# Altium project PCB_Project1.PrjPCB (part 1 of 2)
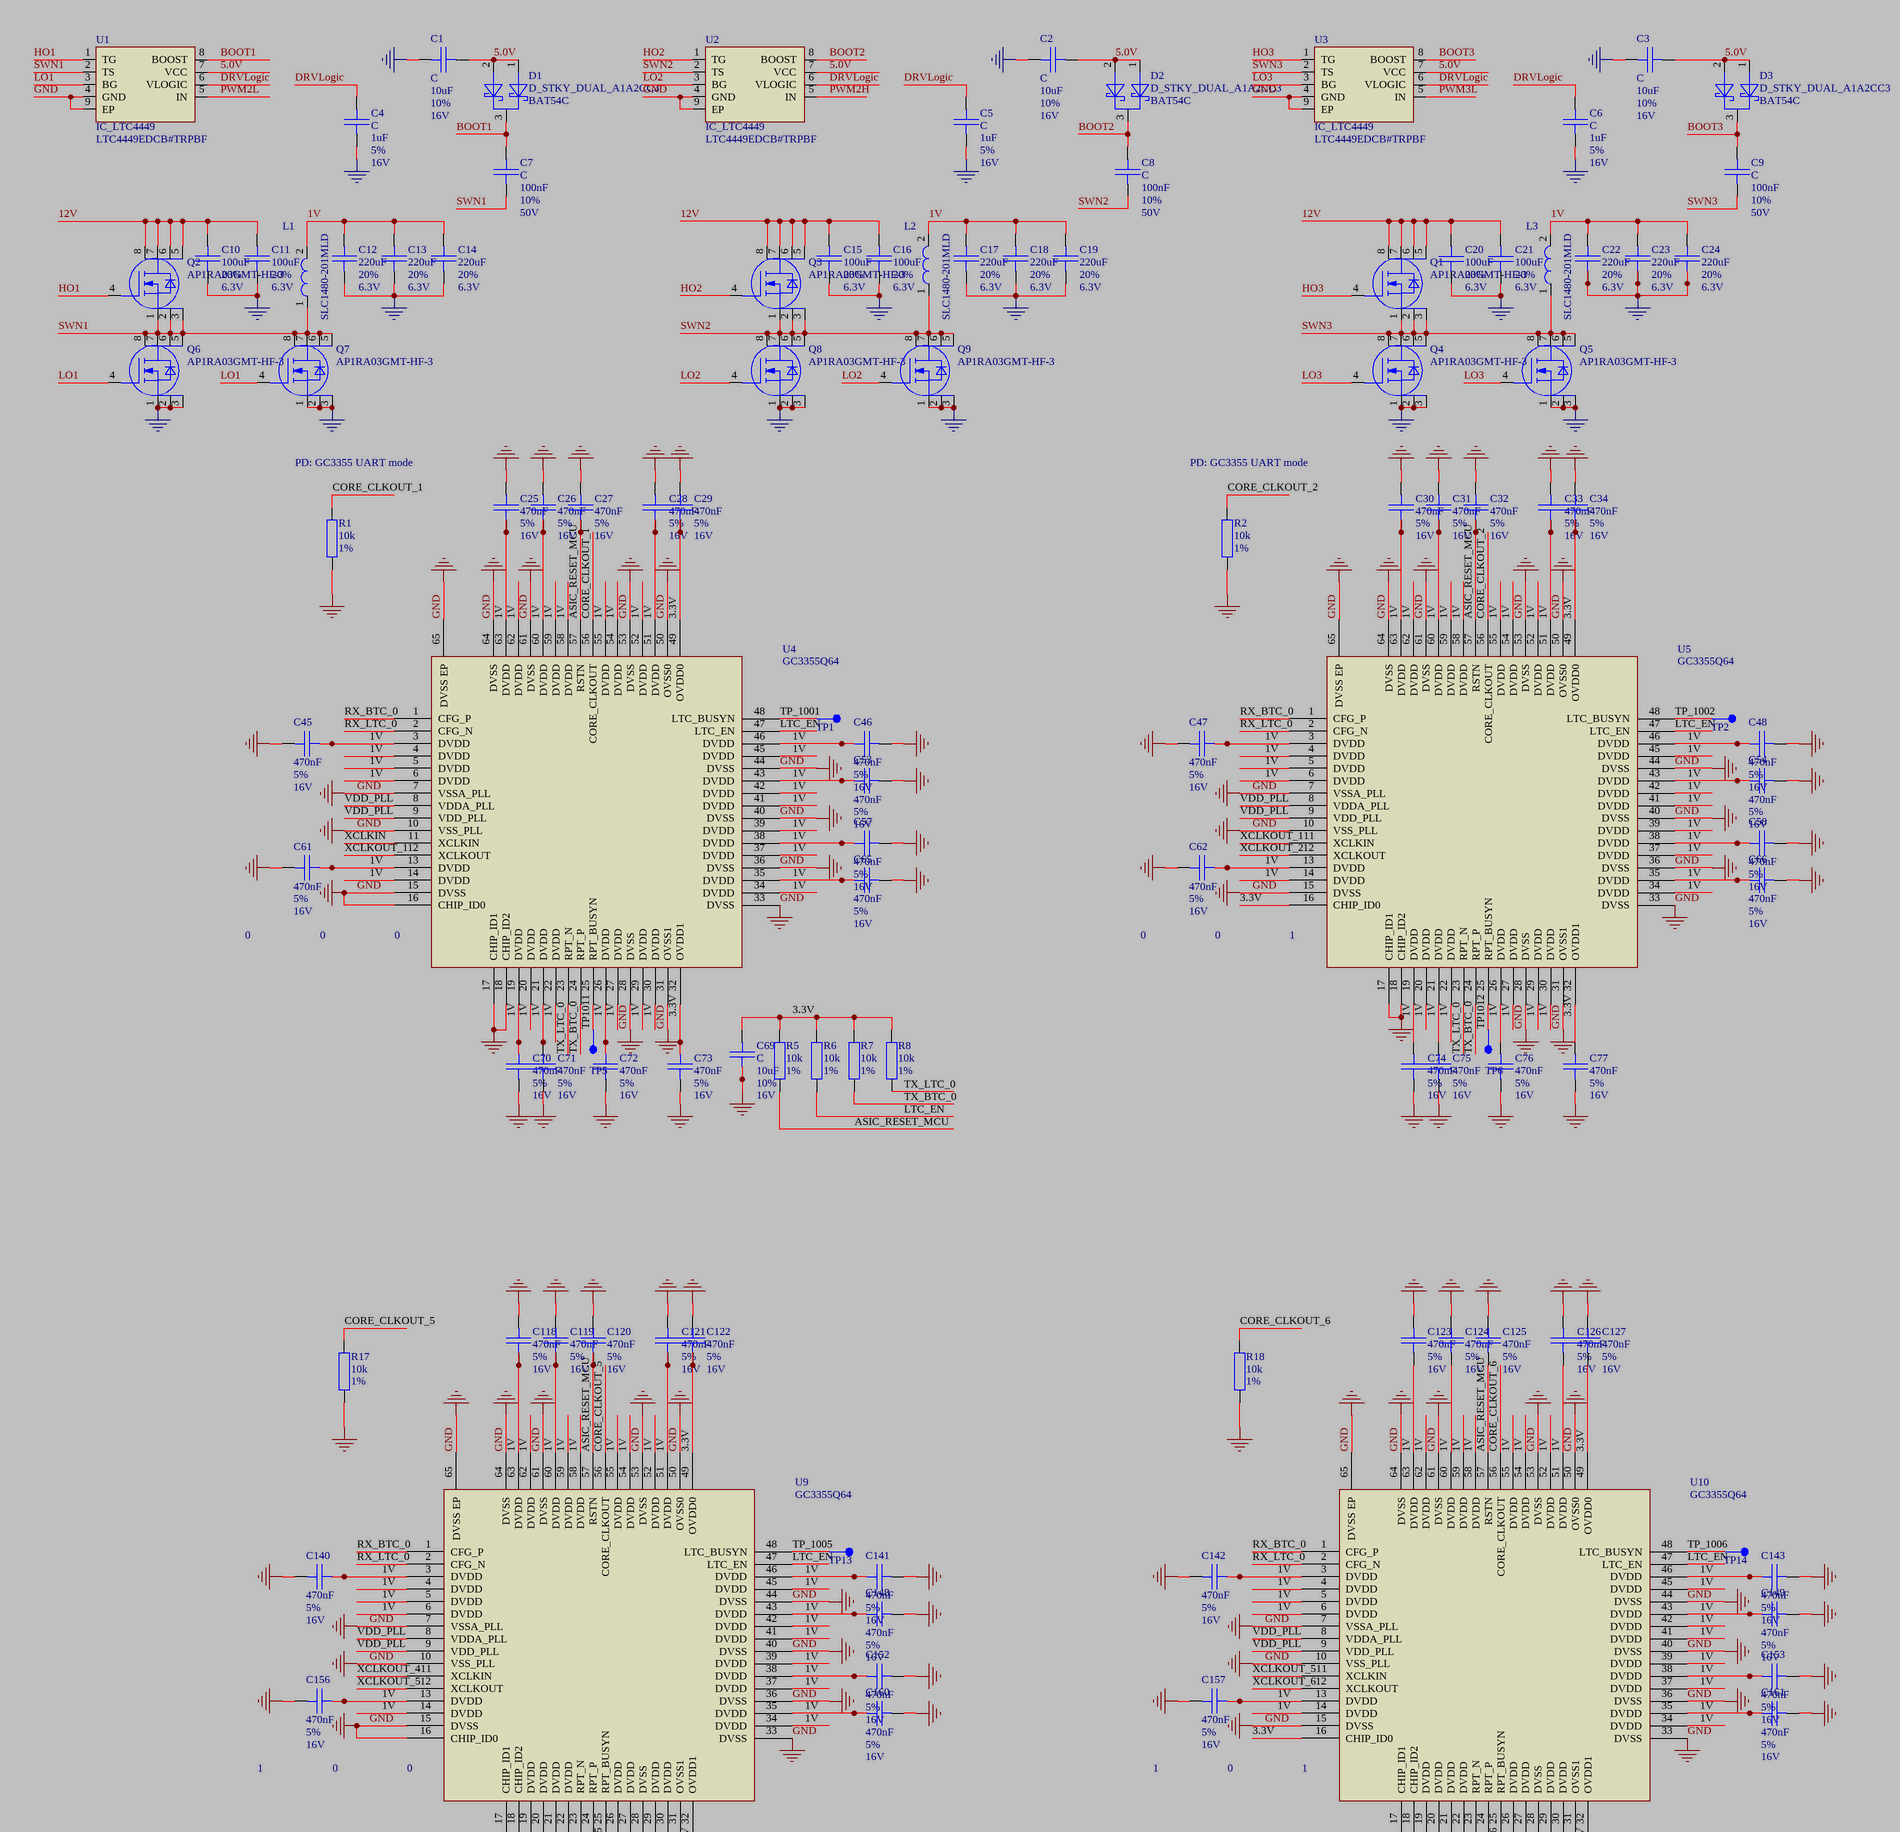
[diagram p0: GridSeed.SchDoc, top left]
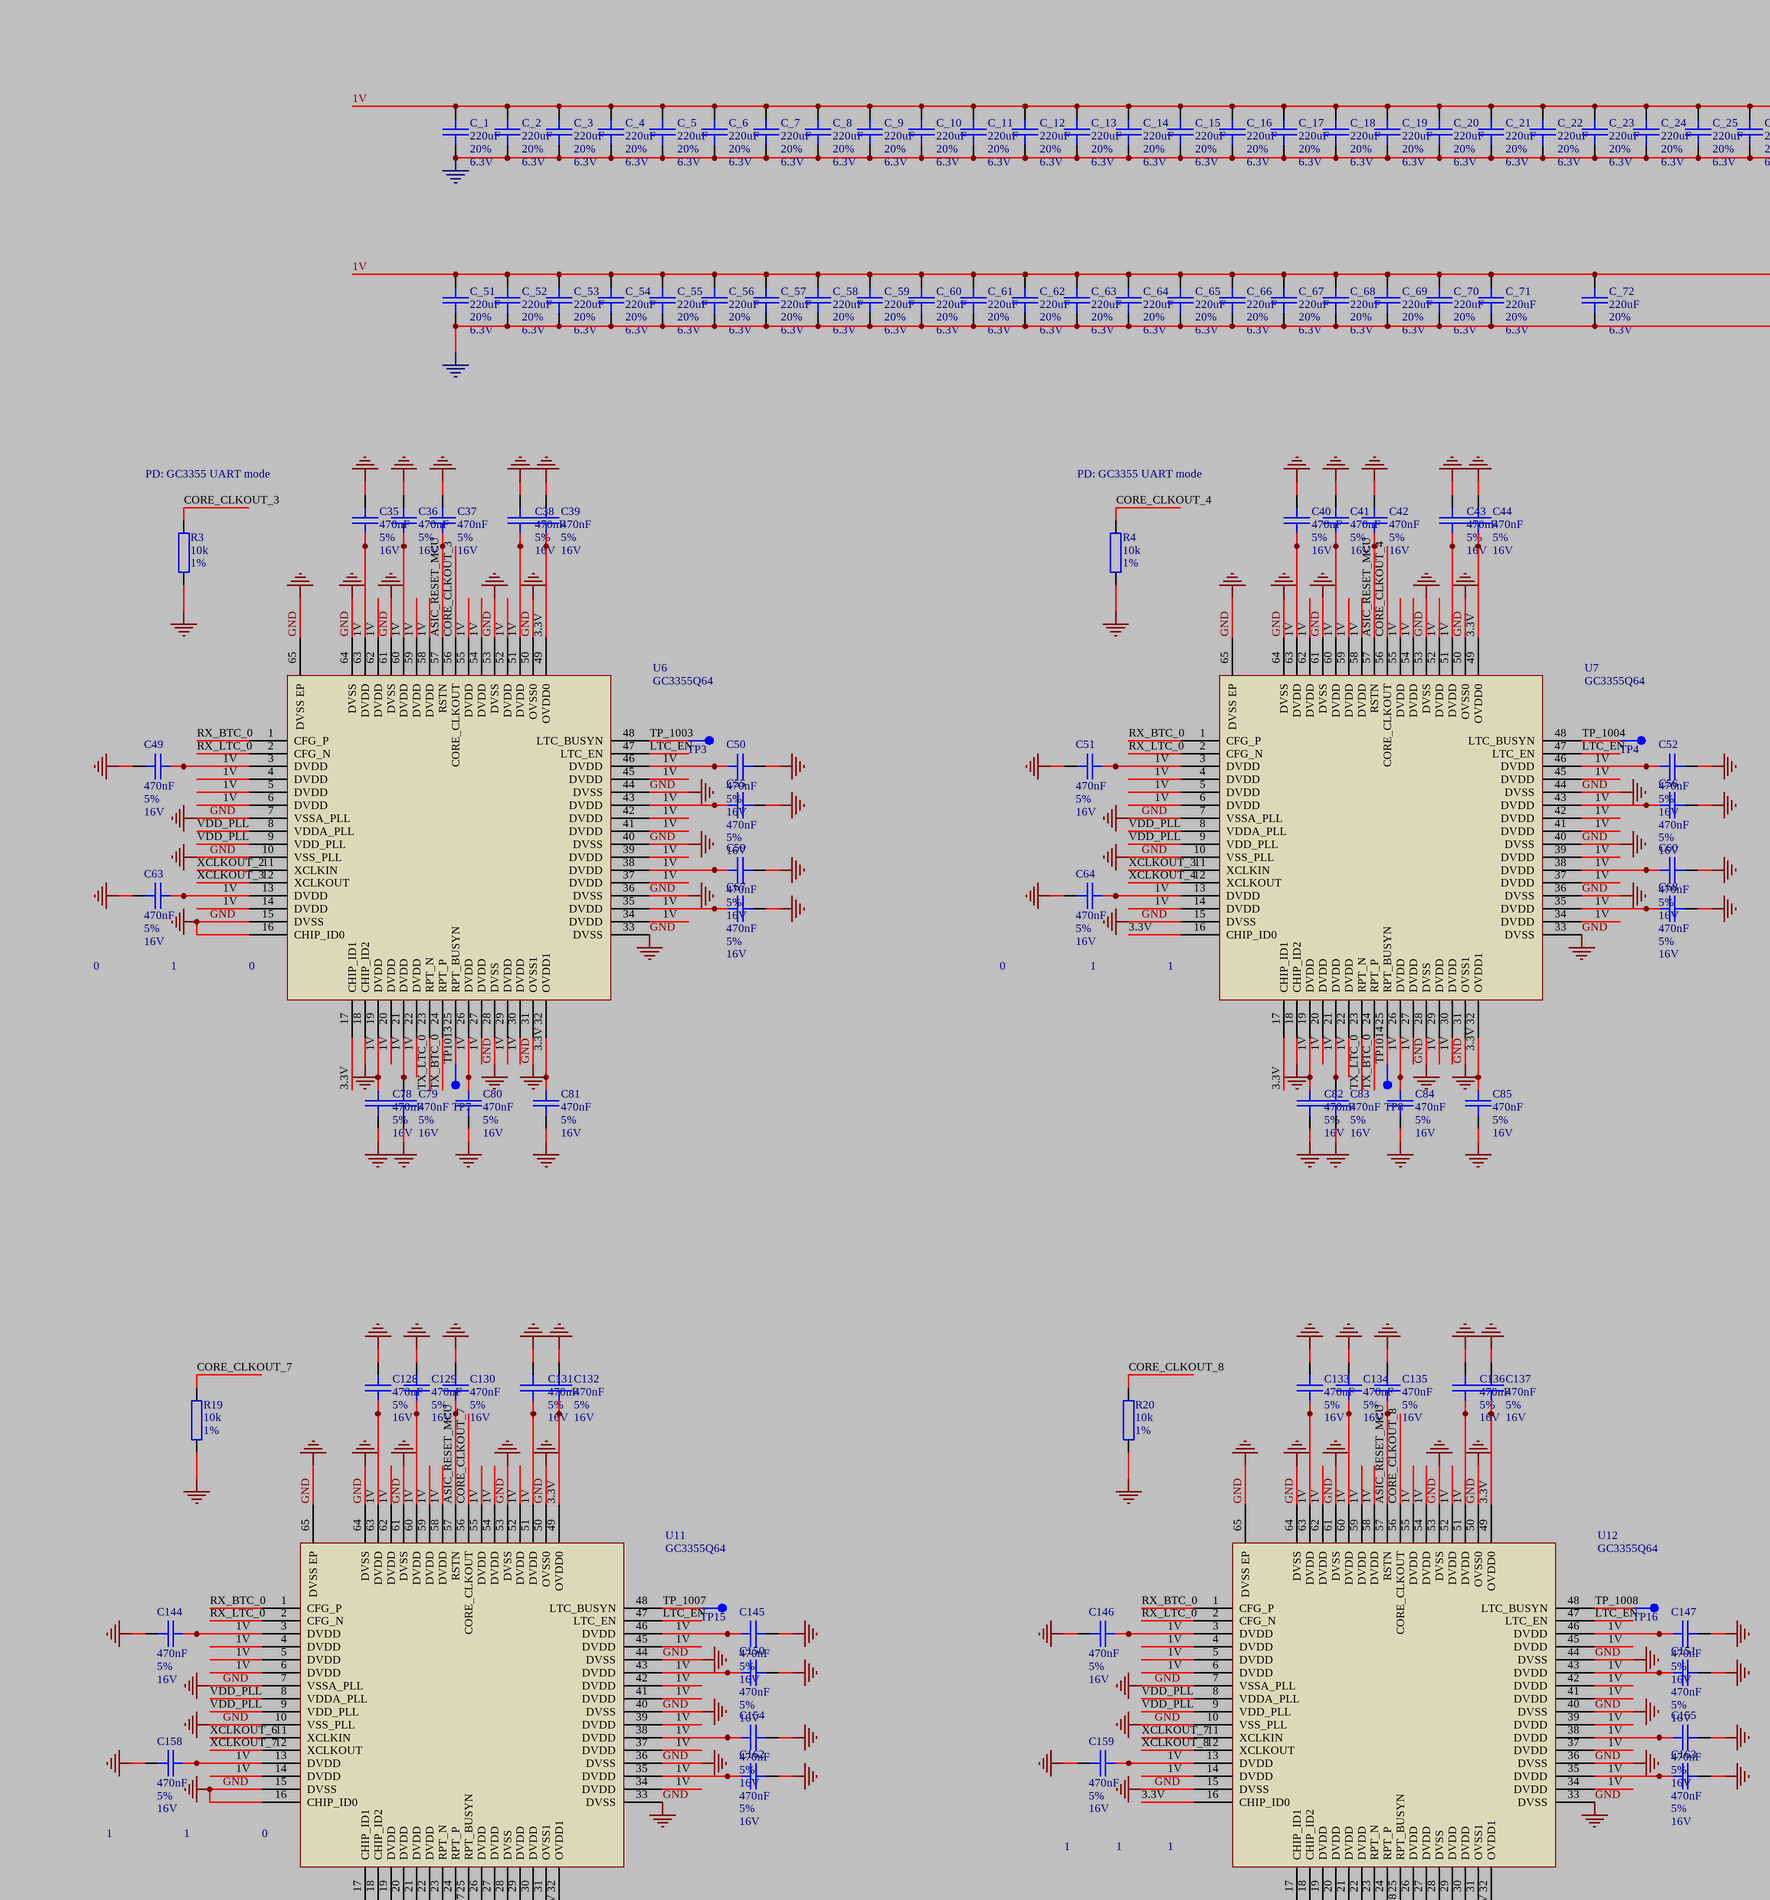
[diagram p1: GridSeed.SchDoc, top middle]
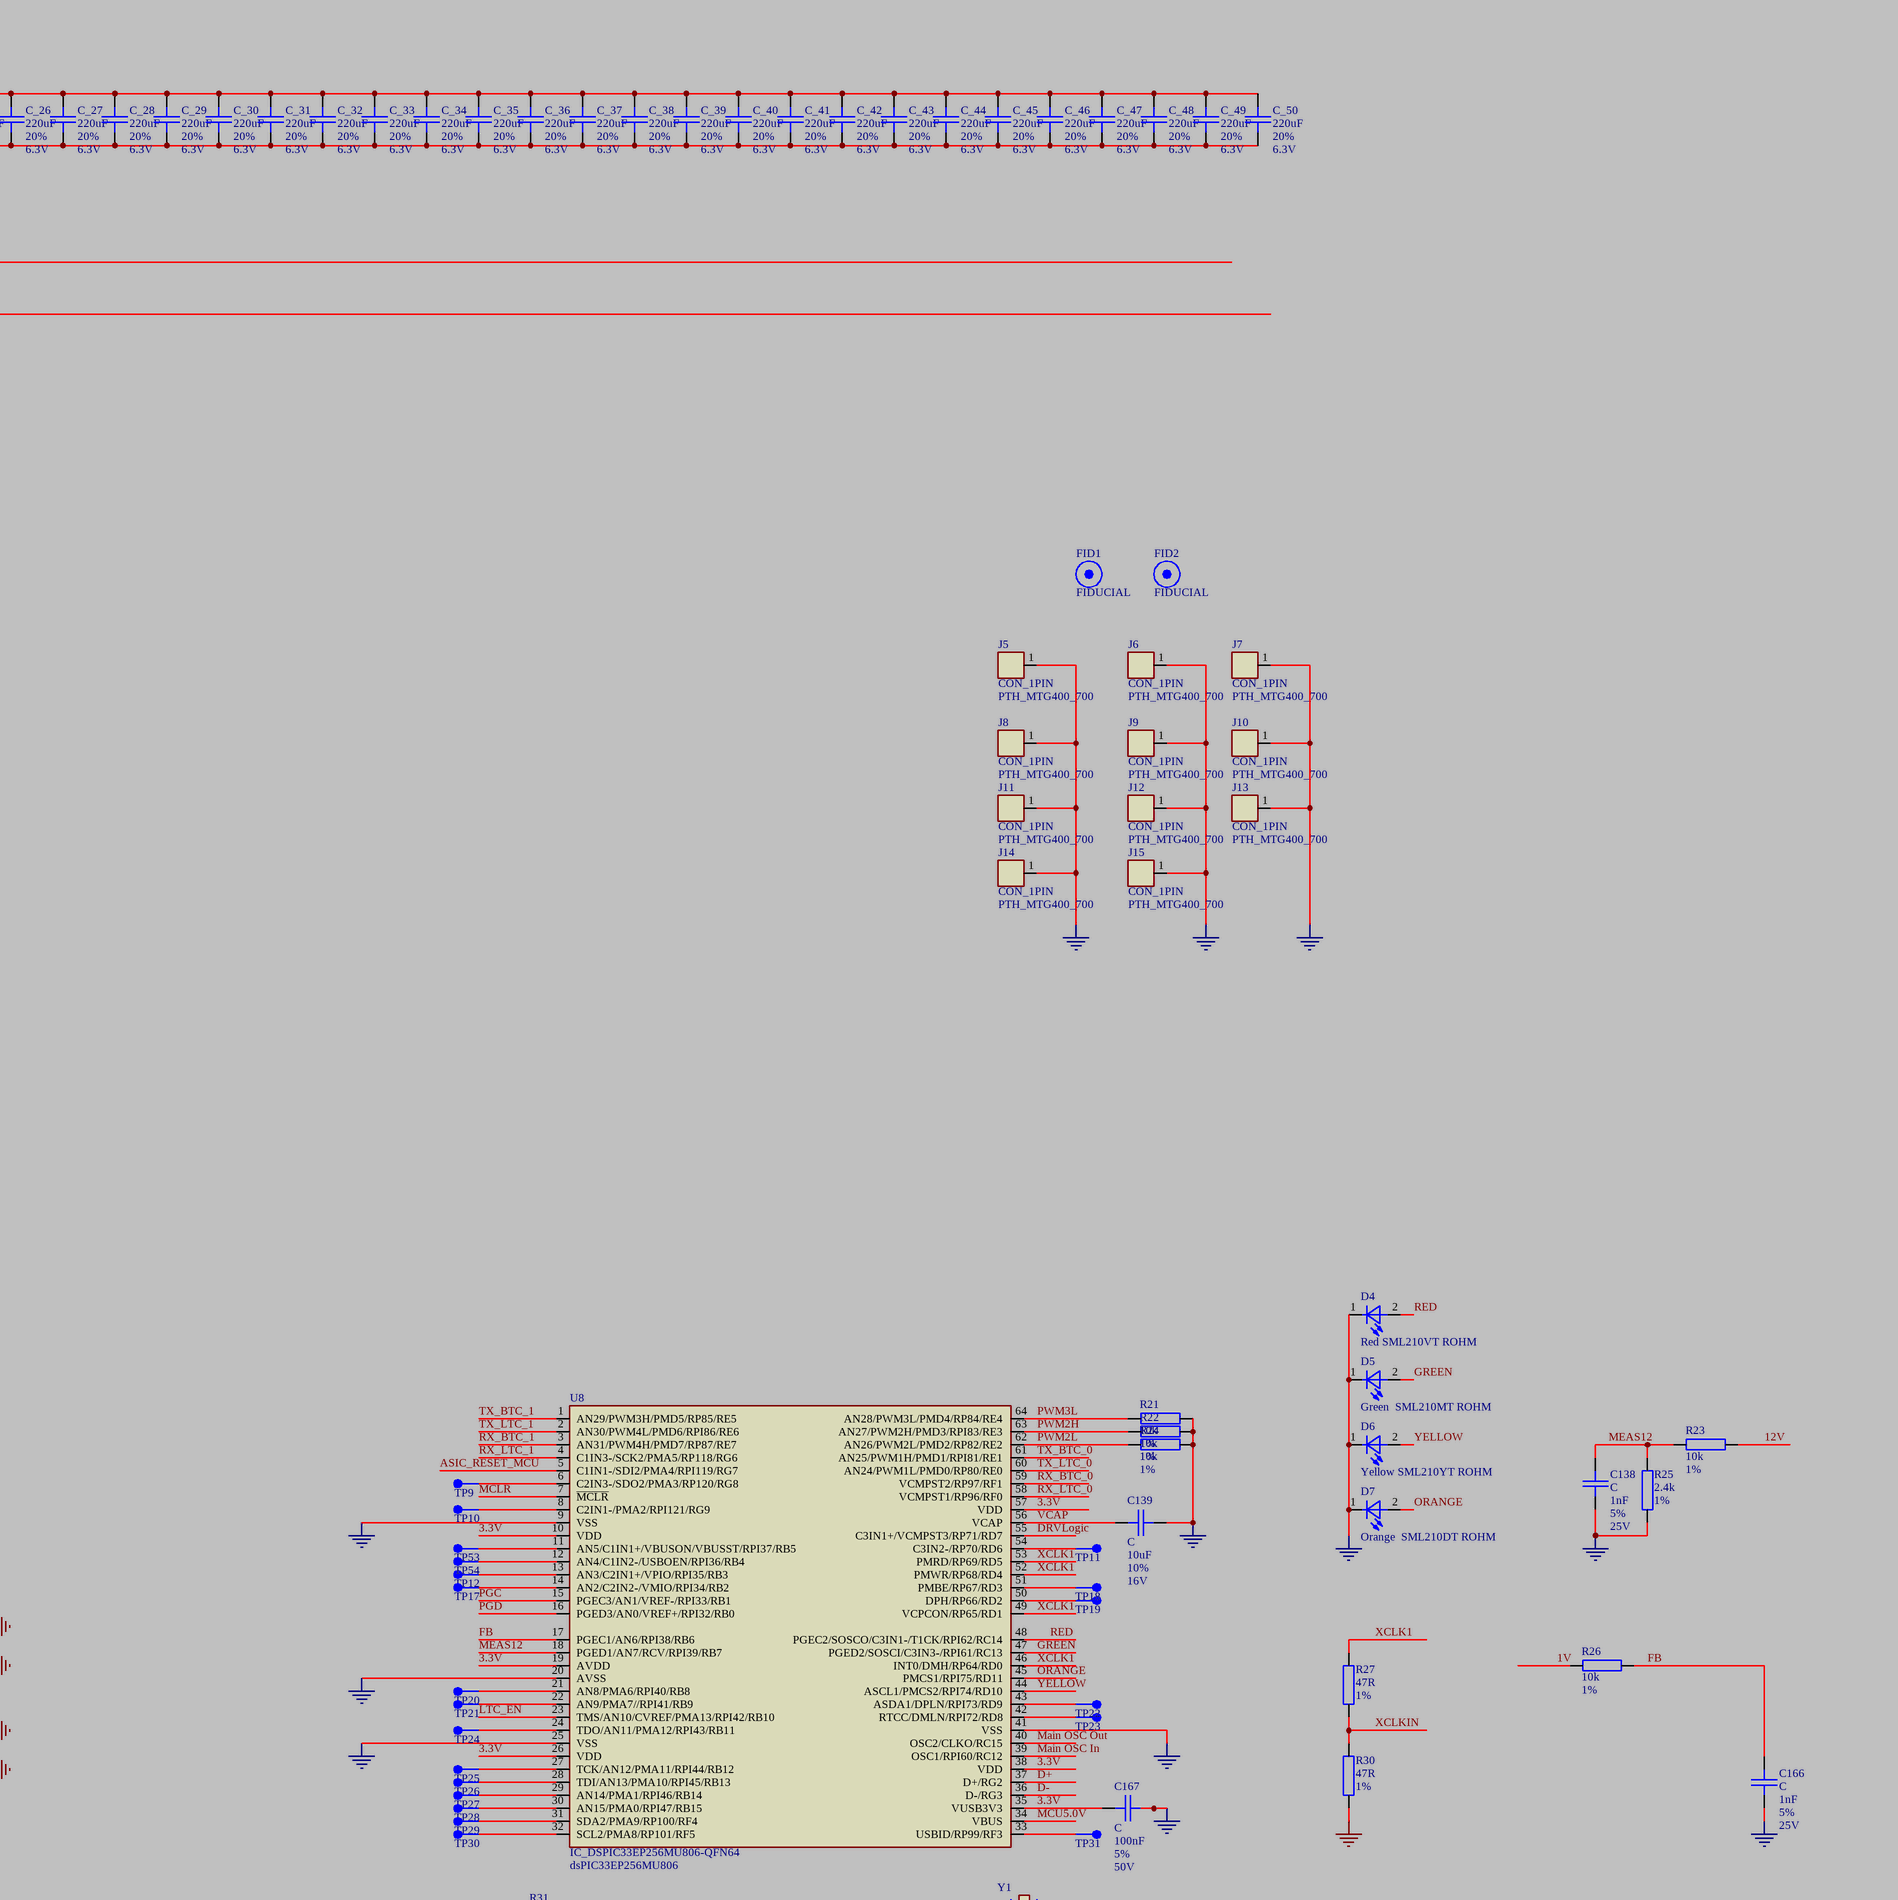
[diagram p2: GridSeed.SchDoc, top right]
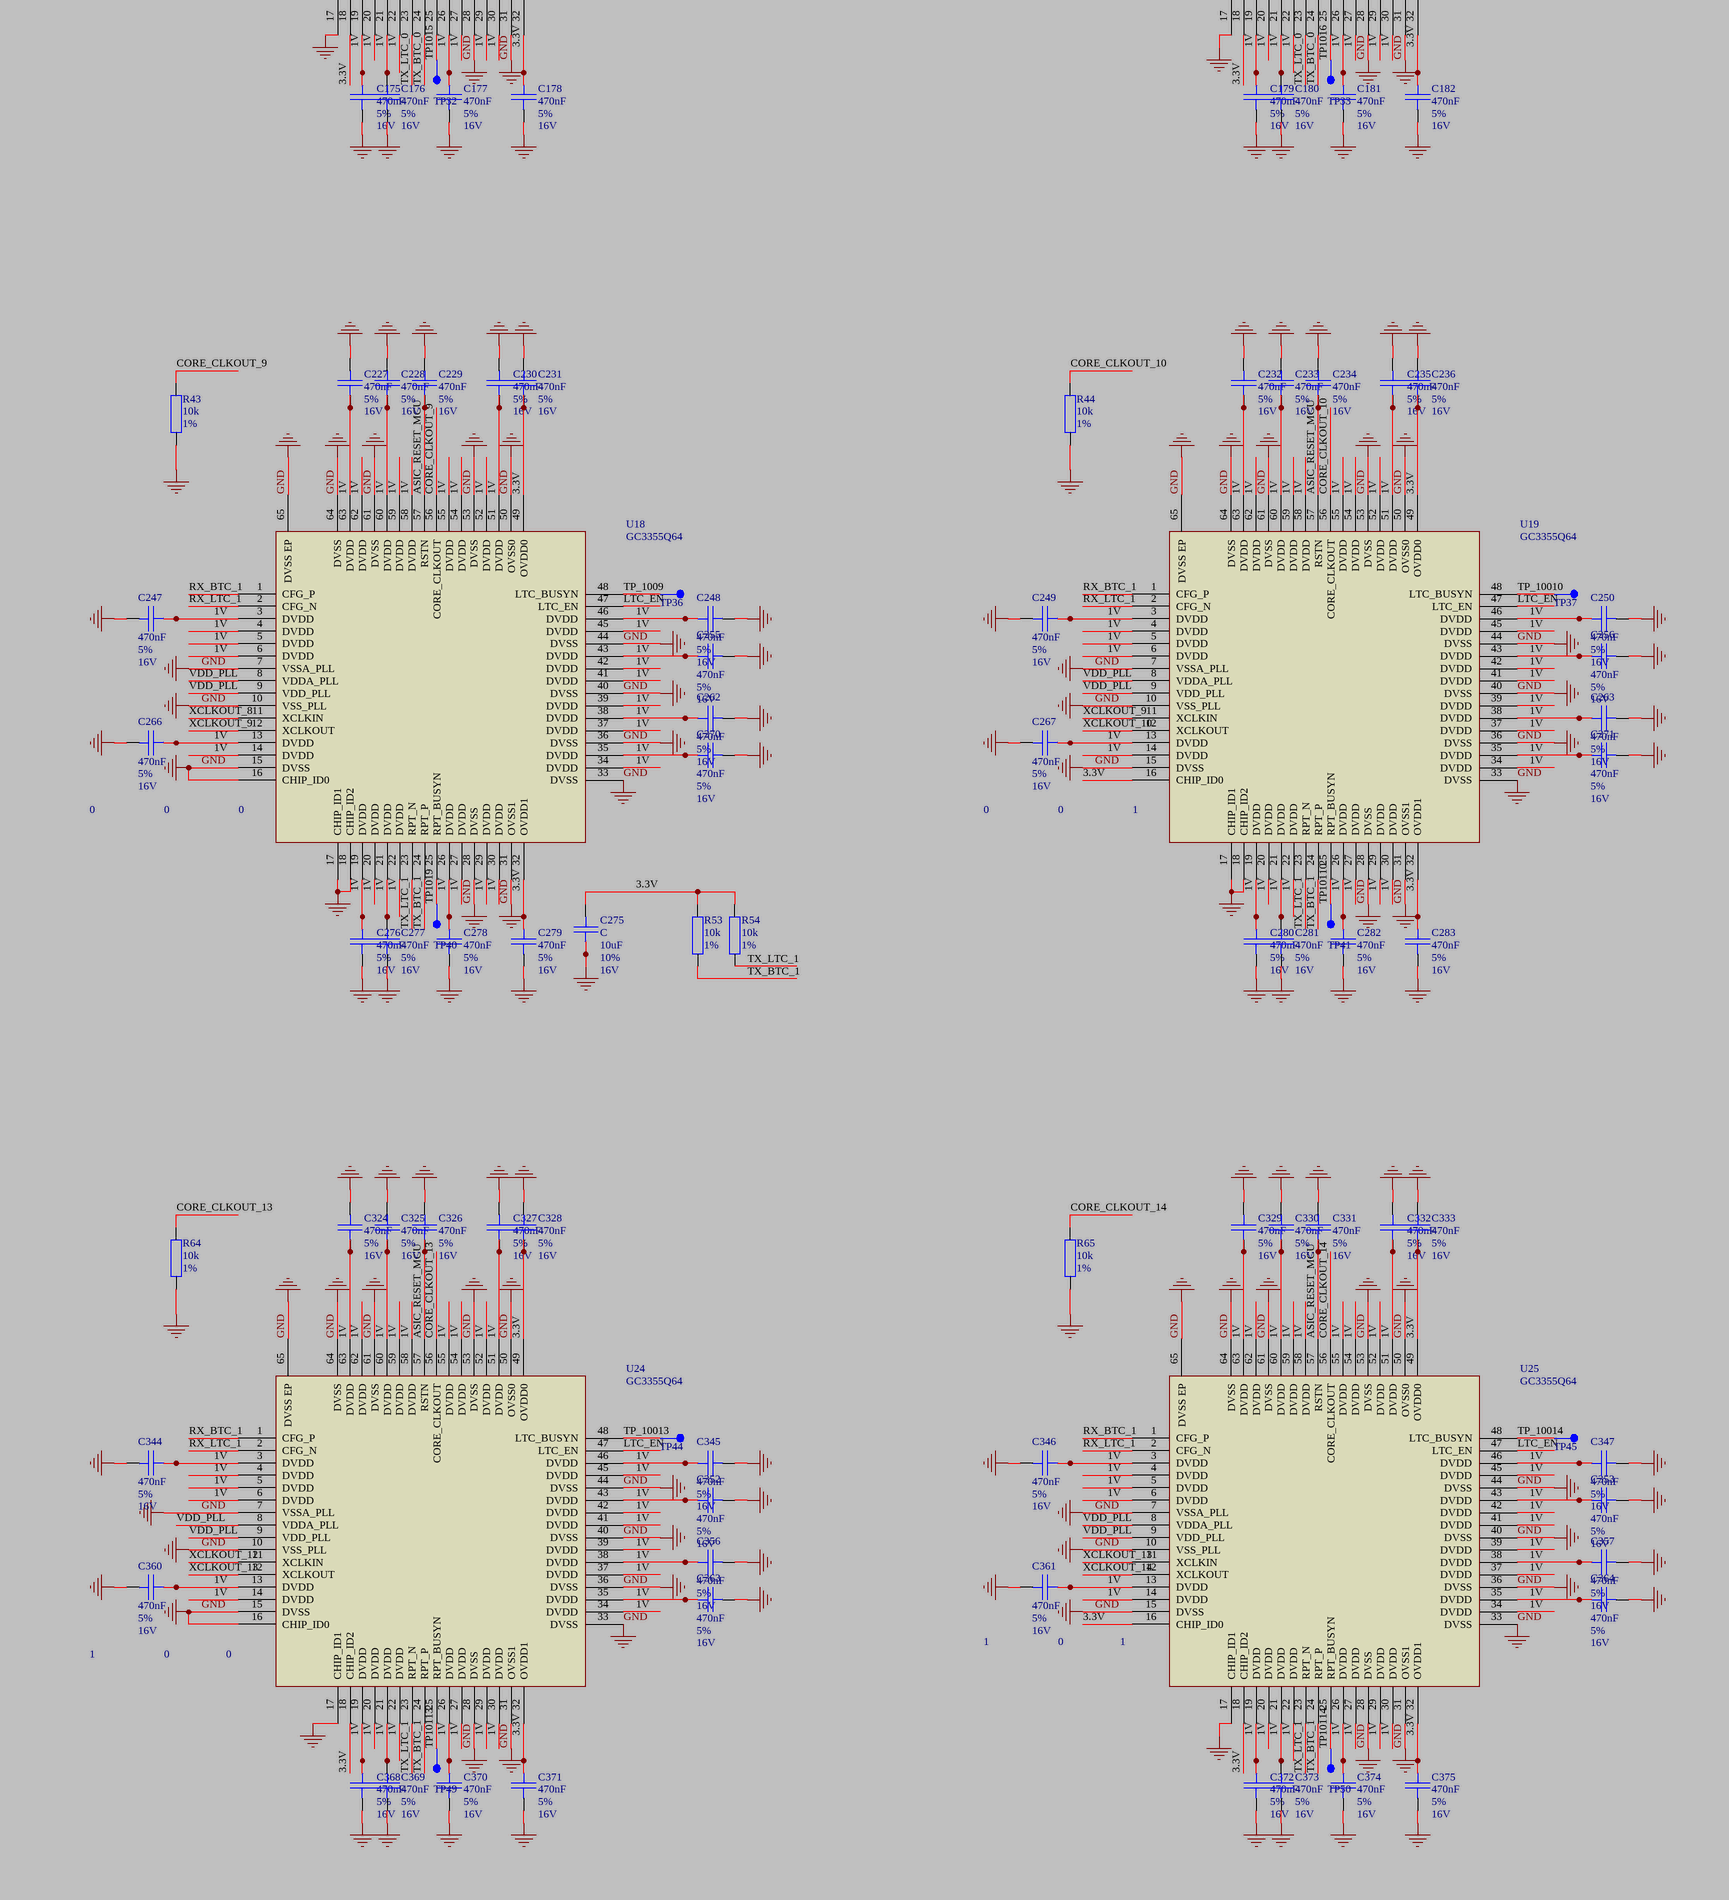
[diagram p3: GridSeed.SchDoc, bottom left]
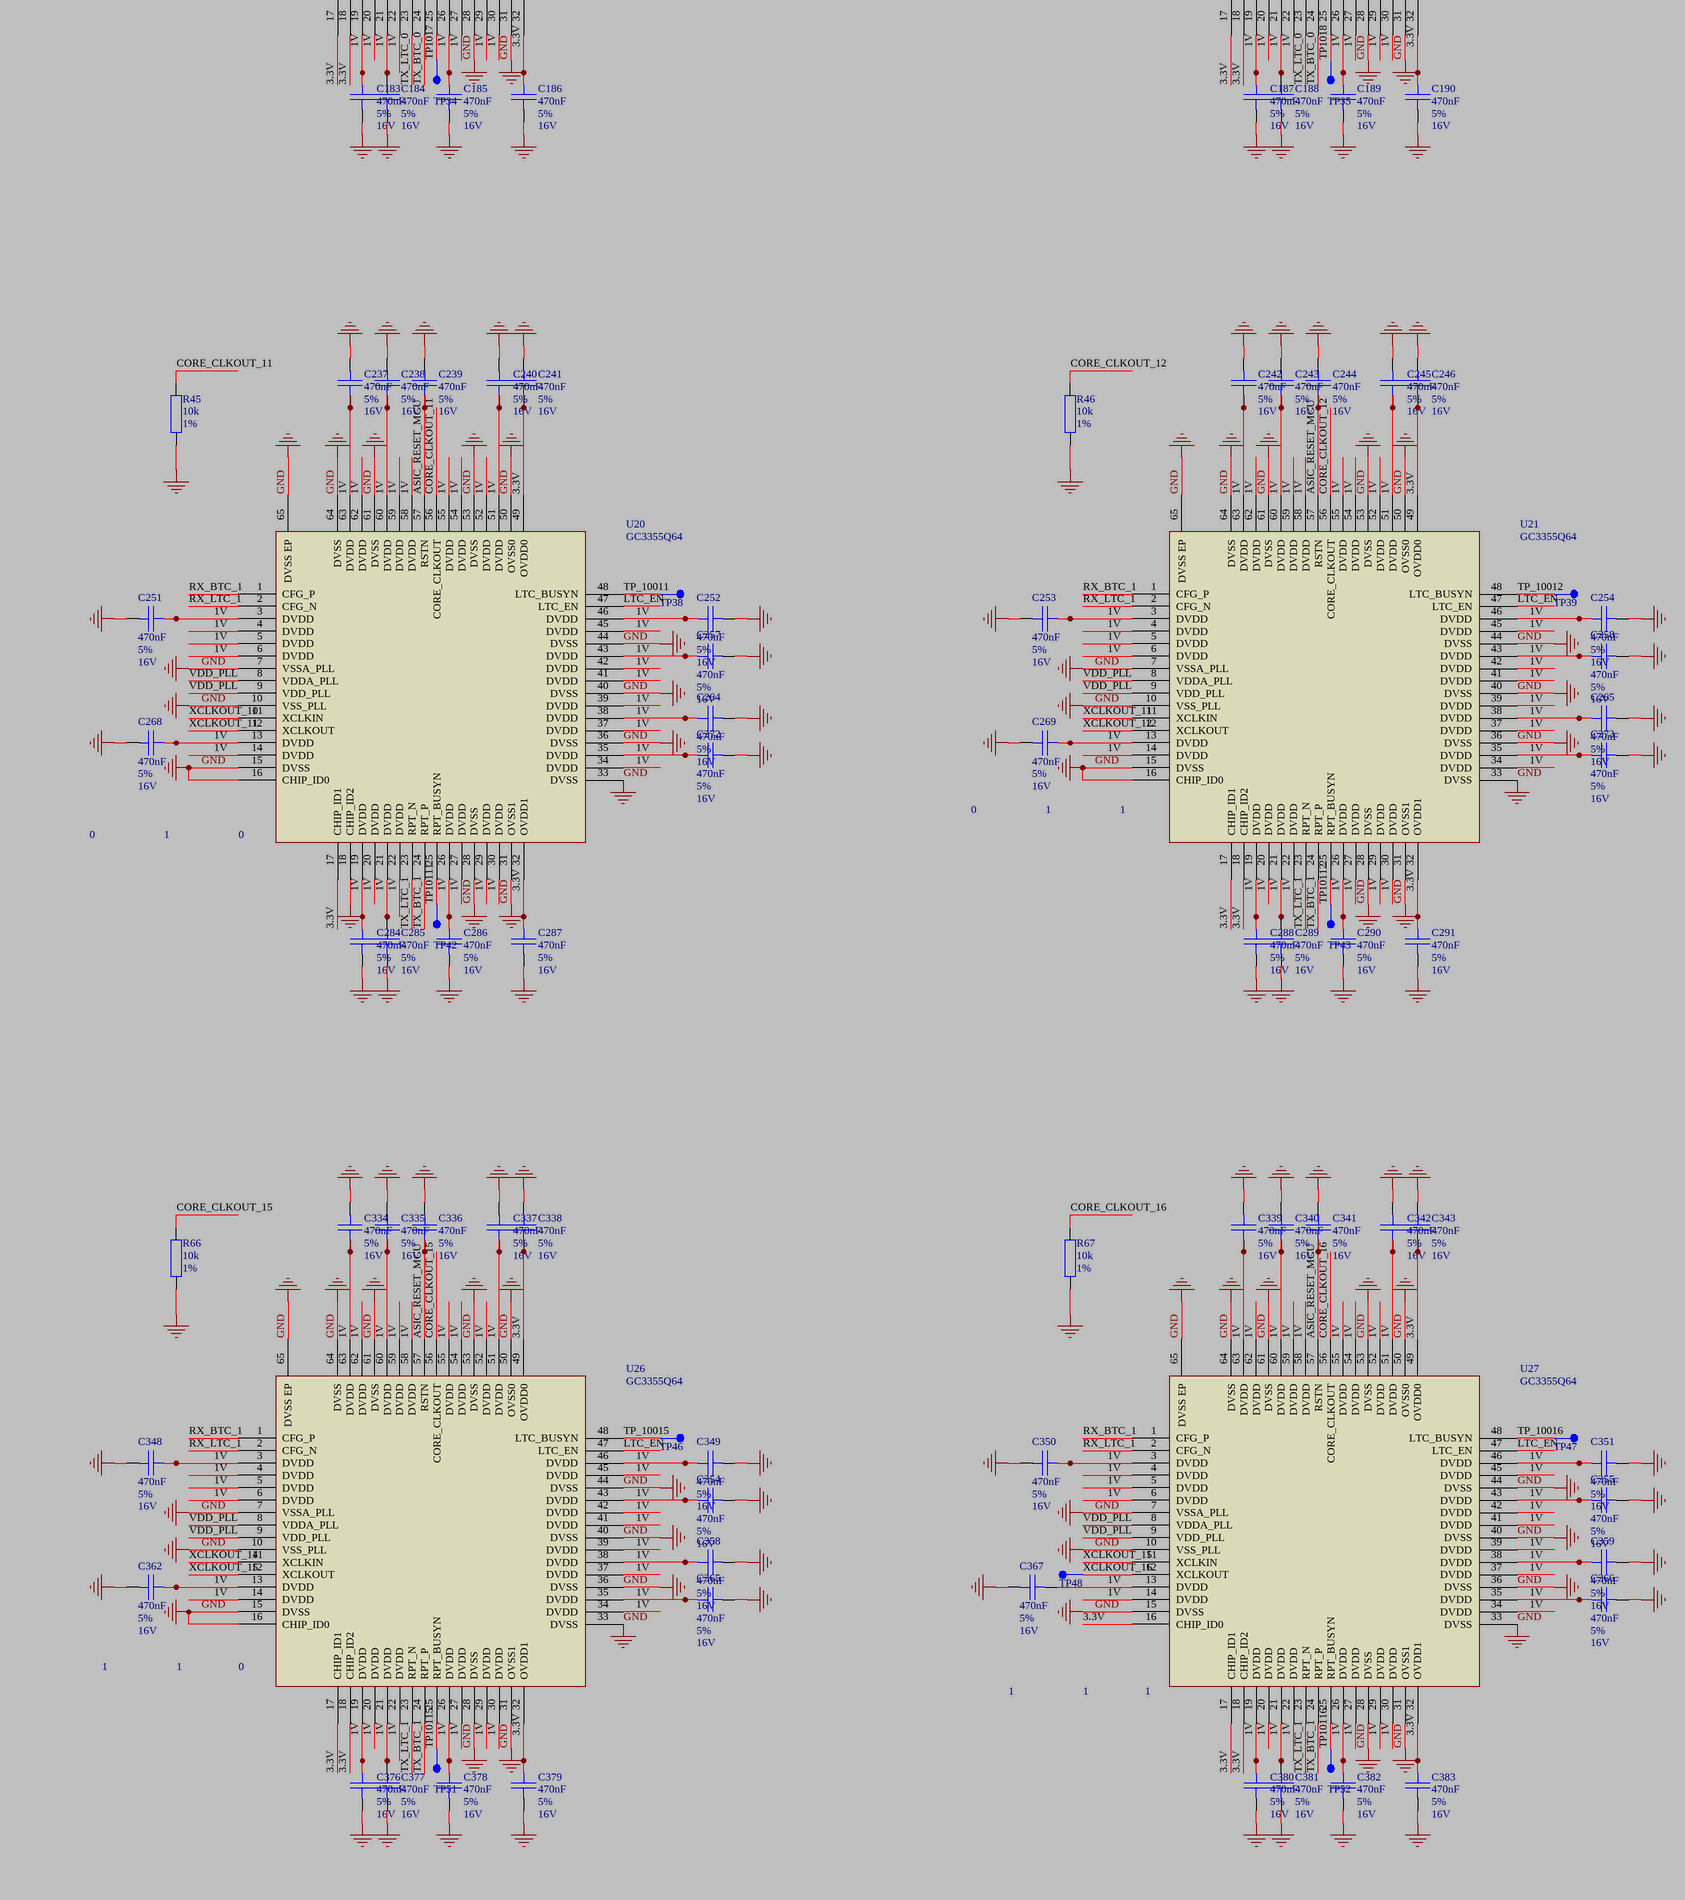
[diagram p4: GridSeed.SchDoc, bottom middle]
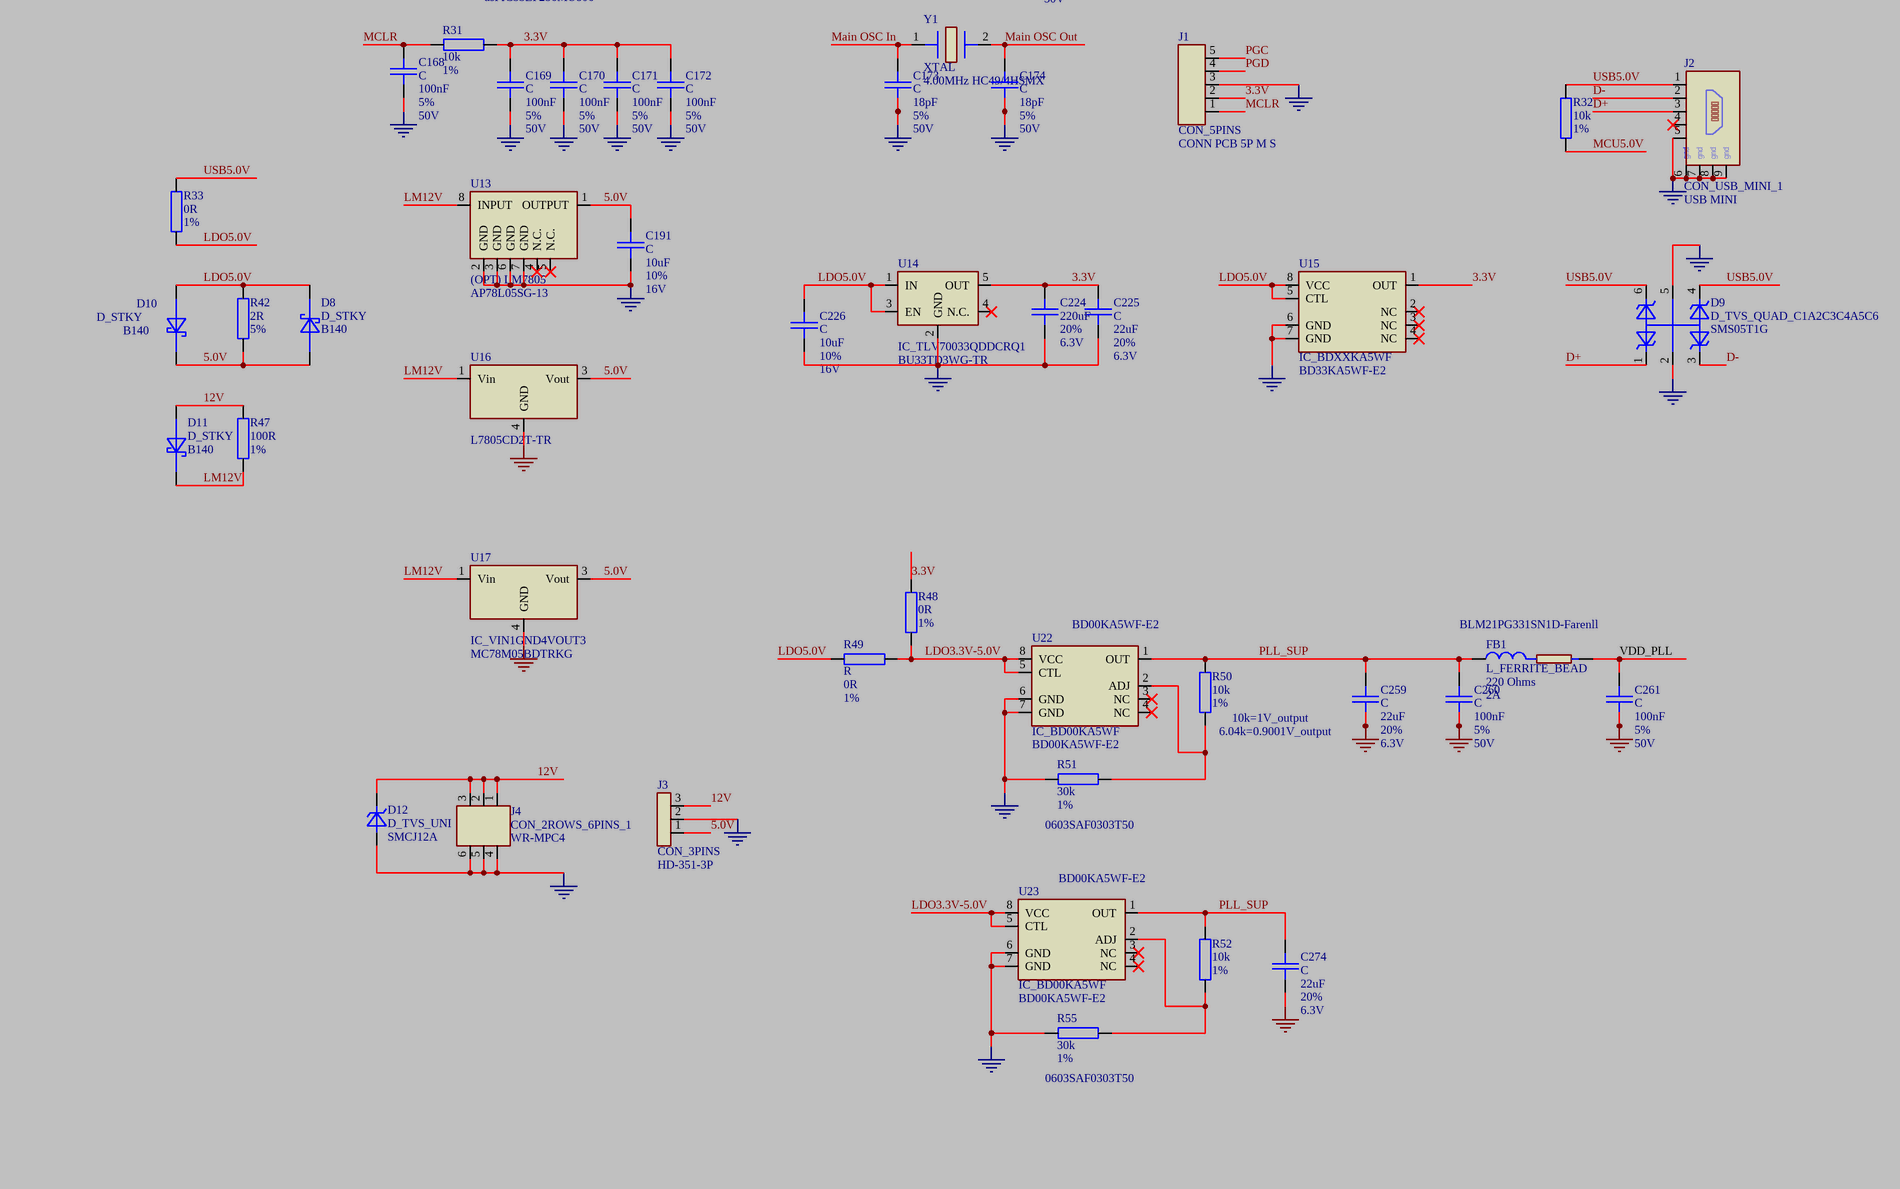
[diagram p5: GridSeed.SchDoc, bottom right]
1 sheet, 522 parts. Net scope: global (net labels, ports and power ports of the same name join across sheets).
Board file: GridSeed_Rev03.PcbDoc

## Sheet GridSeed.SchDoc
size A0; DocumentNumber: 1; SheetNumber: 1; SheetTotal: 1; SheetSize: A3

### Parts
C1  C  DB_VALUE: 10uF  DB_TOLERANCE: 10%  DB_VOLTAGE: 16V  [SMD_0805_CAPC2012X145N]
C2  C  DB_VALUE: 10uF  DB_TOLERANCE: 10%  DB_VOLTAGE: 16V  [SMD_0805_CAPC2012X145N]
C3  C  DB_VALUE: 10uF  DB_TOLERANCE: 10%  DB_VOLTAGE: 16V  [SMD_0805_CAPC2012X145N]
C4  C  DB_VALUE: 1uF  DB_TOLERANCE: 5%  DB_VOLTAGE: 16V  [SMD_0805_CAPC2012X145N]
C5  C  DB_VALUE: 1uF  DB_TOLERANCE: 5%  DB_VOLTAGE: 16V  [SMD_0805_CAPC2012X145N]
C6  C  DB_VALUE: 1uF  DB_TOLERANCE: 5%  DB_VOLTAGE: 16V  [SMD_0805_CAPC2012X145N]
C7  C  DB_VALUE: 100nF  DB_TOLERANCE: 10%  DB_VOLTAGE: 50V  [SMD_0805_CAPC2012X145N]
C8  C  DB_VALUE: 100nF  DB_TOLERANCE: 10%  DB_VOLTAGE: 50V  [SMD_0805_CAPC2012X145N]
C9  C  DB_VALUE: 100nF  DB_TOLERANCE: 10%  DB_VOLTAGE: 50V  [SMD_0805_CAPC2012X145N]
C10  DB_VALUE: 100uF  DB_TOLERANCE: 20%  DB_VOLTAGE: 6.3V  [SMD_1210_CAPC3225X270N]  (hidden comment: C)
C11  DB_VALUE: 100uF  DB_TOLERANCE: 20%  DB_VOLTAGE: 6.3V  [SMD_1210_CAPC3225X270N]  (hidden comment: C)
C12  DB_VALUE: 220uF  DB_TOLERANCE: 20%  DB_VOLTAGE: 6.3V  [SMD_1210_CAPC3225X279N]  (hidden comment: C)
C13  DB_VALUE: 220uF  DB_TOLERANCE: 20%  DB_VOLTAGE: 6.3V  [SMD_1210_CAPC3225X279N]  (hidden comment: C)
C14  DB_VALUE: 220uF  DB_TOLERANCE: 20%  DB_VOLTAGE: 6.3V  [SMD_1210_CAPC3225X279N]  (hidden comment: C)
C15  DB_VALUE: 100uF  DB_TOLERANCE: 20%  DB_VOLTAGE: 6.3V  [SMD_1210_CAPC3225X270N]  (hidden comment: C)
C16  DB_VALUE: 100uF  DB_TOLERANCE: 20%  DB_VOLTAGE: 6.3V  [SMD_1210_CAPC3225X270N]  (hidden comment: C)
C17  DB_VALUE: 220uF  DB_TOLERANCE: 20%  DB_VOLTAGE: 6.3V  [SMD_1210_CAPC3225X279N]  (hidden comment: C)
C18  DB_VALUE: 220uF  DB_TOLERANCE: 20%  DB_VOLTAGE: 6.3V  [SMD_1210_CAPC3225X279N]  (hidden comment: C)
C19  DB_VALUE: 220uF  DB_TOLERANCE: 20%  DB_VOLTAGE: 6.3V  [SMD_1210_CAPC3225X279N]  (hidden comment: C)
C20  DB_VALUE: 100uF  DB_TOLERANCE: 20%  DB_VOLTAGE: 6.3V  [SMD_1210_CAPC3225X270N]  (hidden comment: C)
C21  DB_VALUE: 100uF  DB_TOLERANCE: 20%  DB_VOLTAGE: 6.3V  [SMD_1210_CAPC3225X270N]  (hidden comment: C)
C22  DB_VALUE: 220uF  DB_TOLERANCE: 20%  DB_VOLTAGE: 6.3V  [SMD_1210_CAPC3225X279N]  (hidden comment: C)
C23  DB_VALUE: 220uF  DB_TOLERANCE: 20%  DB_VOLTAGE: 6.3V  [SMD_1210_CAPC3225X279N]  (hidden comment: C)
C24  DB_VALUE: 220uF  DB_TOLERANCE: 20%  DB_VOLTAGE: 6.3V  [SMD_1210_CAPC3225X279N]  (hidden comment: C)
C25  DB_VALUE: 470nF  DB_TOLERANCE: 5%  DB_VOLTAGE: 16V  [SMD_0603_CAPC1608X95N]  (hidden comment: C)
C26  DB_VALUE: 470nF  DB_TOLERANCE: 5%  DB_VOLTAGE: 16V  [SMD_0603_CAPC1608X95N]  (hidden comment: C)
C27  DB_VALUE: 470nF  DB_TOLERANCE: 5%  DB_VOLTAGE: 16V  [SMD_0603_CAPC1608X95N]  (hidden comment: C)
C28  DB_VALUE: 470nF  DB_TOLERANCE: 5%  DB_VOLTAGE: 16V  [SMD_0603_CAPC1608X95N]  (hidden comment: C)
C29  DB_VALUE: 470nF  DB_TOLERANCE: 5%  DB_VOLTAGE: 16V  [SMD_0603_CAPC1608X95N]  (hidden comment: C)
C30  DB_VALUE: 470nF  DB_TOLERANCE: 5%  DB_VOLTAGE: 16V  [SMD_0603_CAPC1608X95N]  (hidden comment: C)
C31  DB_VALUE: 470nF  DB_TOLERANCE: 5%  DB_VOLTAGE: 16V  [SMD_0603_CAPC1608X95N]  (hidden comment: C)
C32  DB_VALUE: 470nF  DB_TOLERANCE: 5%  DB_VOLTAGE: 16V  [SMD_0603_CAPC1608X95N]  (hidden comment: C)
C33  DB_VALUE: 470nF  DB_TOLERANCE: 5%  DB_VOLTAGE: 16V  [SMD_0603_CAPC1608X95N]  (hidden comment: C)
C34  DB_VALUE: 470nF  DB_TOLERANCE: 5%  DB_VOLTAGE: 16V  [SMD_0603_CAPC1608X95N]  (hidden comment: C)
C35  DB_VALUE: 470nF  DB_TOLERANCE: 5%  DB_VOLTAGE: 16V  [SMD_0603_CAPC1608X95N]  (hidden comment: C)
C36  DB_VALUE: 470nF  DB_TOLERANCE: 5%  DB_VOLTAGE: 16V  [SMD_0603_CAPC1608X95N]  (hidden comment: C)
C37  DB_VALUE: 470nF  DB_TOLERANCE: 5%  DB_VOLTAGE: 16V  [SMD_0603_CAPC1608X95N]  (hidden comment: C)
C38  DB_VALUE: 470nF  DB_TOLERANCE: 5%  DB_VOLTAGE: 16V  [SMD_0603_CAPC1608X95N]  (hidden comment: C)
C39  DB_VALUE: 470nF  DB_TOLERANCE: 5%  DB_VOLTAGE: 16V  [SMD_0603_CAPC1608X95N]  (hidden comment: C)
C40  DB_VALUE: 470nF  DB_TOLERANCE: 5%  DB_VOLTAGE: 16V  [SMD_0603_CAPC1608X95N]  (hidden comment: C)
C41  DB_VALUE: 470nF  DB_TOLERANCE: 5%  DB_VOLTAGE: 16V  [SMD_0603_CAPC1608X95N]  (hidden comment: C)
C42  DB_VALUE: 470nF  DB_TOLERANCE: 5%  DB_VOLTAGE: 16V  [SMD_0603_CAPC1608X95N]  (hidden comment: C)
C43  DB_VALUE: 470nF  DB_TOLERANCE: 5%  DB_VOLTAGE: 16V  [SMD_0603_CAPC1608X95N]  (hidden comment: C)
C44  DB_VALUE: 470nF  DB_TOLERANCE: 5%  DB_VOLTAGE: 16V  [SMD_0603_CAPC1608X95N]  (hidden comment: C)
C45  DB_VALUE: 470nF  DB_TOLERANCE: 5%  DB_VOLTAGE: 16V  [SMD_0603_CAPC1608X95N]  (hidden comment: C)
C46  DB_VALUE: 470nF  DB_TOLERANCE: 5%  DB_VOLTAGE: 16V  [SMD_0603_CAPC1608X95N]  (hidden comment: C)
C47  DB_VALUE: 470nF  DB_TOLERANCE: 5%  DB_VOLTAGE: 16V  [SMD_0603_CAPC1608X95N]  (hidden comment: C)
C48  DB_VALUE: 470nF  DB_TOLERANCE: 5%  DB_VOLTAGE: 16V  [SMD_0603_CAPC1608X95N]  (hidden comment: C)
C49  DB_VALUE: 470nF  DB_TOLERANCE: 5%  DB_VOLTAGE: 16V  [SMD_0603_CAPC1608X95N]  (hidden comment: C)
C50  DB_VALUE: 470nF  DB_TOLERANCE: 5%  DB_VOLTAGE: 16V  [SMD_0603_CAPC1608X95N]  (hidden comment: C)
C51  DB_VALUE: 470nF  DB_TOLERANCE: 5%  DB_VOLTAGE: 16V  [SMD_0603_CAPC1608X95N]  (hidden comment: C)
C52  DB_VALUE: 470nF  DB_TOLERANCE: 5%  DB_VOLTAGE: 16V  [SMD_0603_CAPC1608X95N]  (hidden comment: C)
C53  DB_VALUE: 470nF  DB_TOLERANCE: 5%  DB_VOLTAGE: 16V  [SMD_0603_CAPC1608X95N]  (hidden comment: C)
C54  DB_VALUE: 470nF  DB_TOLERANCE: 5%  DB_VOLTAGE: 16V  [SMD_0603_CAPC1608X95N]  (hidden comment: C)
C55  DB_VALUE: 470nF  DB_TOLERANCE: 5%  DB_VOLTAGE: 16V  [SMD_0603_CAPC1608X95N]  (hidden comment: C)
C56  DB_VALUE: 470nF  DB_TOLERANCE: 5%  DB_VOLTAGE: 16V  [SMD_0603_CAPC1608X95N]  (hidden comment: C)
C57  DB_VALUE: 470nF  DB_TOLERANCE: 5%  DB_VOLTAGE: 16V  [SMD_0603_CAPC1608X95N]  (hidden comment: C)
C58  DB_VALUE: 470nF  DB_TOLERANCE: 5%  DB_VOLTAGE: 16V  [SMD_0603_CAPC1608X95N]  (hidden comment: C)
C59  DB_VALUE: 470nF  DB_TOLERANCE: 5%  DB_VOLTAGE: 16V  [SMD_0603_CAPC1608X95N]  (hidden comment: C)
C60  DB_VALUE: 470nF  DB_TOLERANCE: 5%  DB_VOLTAGE: 16V  [SMD_0603_CAPC1608X95N]  (hidden comment: C)
C61  DB_VALUE: 470nF  DB_TOLERANCE: 5%  DB_VOLTAGE: 16V  [SMD_0603_CAPC1608X95N]  (hidden comment: C)
C62  DB_VALUE: 470nF  DB_TOLERANCE: 5%  DB_VOLTAGE: 16V  [SMD_0603_CAPC1608X95N]  (hidden comment: C)
C63  DB_VALUE: 470nF  DB_TOLERANCE: 5%  DB_VOLTAGE: 16V  [SMD_0603_CAPC1608X95N]  (hidden comment: C)
C64  DB_VALUE: 470nF  DB_TOLERANCE: 5%  DB_VOLTAGE: 16V  [SMD_0603_CAPC1608X95N]  (hidden comment: C)
C65  DB_VALUE: 470nF  DB_TOLERANCE: 5%  DB_VOLTAGE: 16V  [SMD_0603_CAPC1608X95N]  (hidden comment: C)
C66  DB_VALUE: 470nF  DB_TOLERANCE: 5%  DB_VOLTAGE: 16V  [SMD_0603_CAPC1608X95N]  (hidden comment: C)
C67  DB_VALUE: 470nF  DB_TOLERANCE: 5%  DB_VOLTAGE: 16V  [SMD_0603_CAPC1608X95N]  (hidden comment: C)
C68  DB_VALUE: 470nF  DB_TOLERANCE: 5%  DB_VOLTAGE: 16V  [SMD_0603_CAPC1608X95N]  (hidden comment: C)
C69  C  DB_VALUE: 10uF  DB_TOLERANCE: 10%  DB_VOLTAGE: 16V  [SMD_0805_CAPC2012X145N]
C70  DB_VALUE: 470nF  DB_TOLERANCE: 5%  DB_VOLTAGE: 16V  [SMD_0603_CAPC1608X95N]  (hidden comment: C)
C71  DB_VALUE: 470nF  DB_TOLERANCE: 5%  DB_VOLTAGE: 16V  [SMD_0603_CAPC1608X95N]  (hidden comment: C)
C72  DB_VALUE: 470nF  DB_TOLERANCE: 5%  DB_VOLTAGE: 16V  [SMD_0603_CAPC1608X95N]  (hidden comment: C)
C73  DB_VALUE: 470nF  DB_TOLERANCE: 5%  DB_VOLTAGE: 16V  [SMD_0603_CAPC1608X95N]  (hidden comment: C)
C74  DB_VALUE: 470nF  DB_TOLERANCE: 5%  DB_VOLTAGE: 16V  [SMD_0603_CAPC1608X95N]  (hidden comment: C)
C75  DB_VALUE: 470nF  DB_TOLERANCE: 5%  DB_VOLTAGE: 16V  [SMD_0603_CAPC1608X95N]  (hidden comment: C)
C76  DB_VALUE: 470nF  DB_TOLERANCE: 5%  DB_VOLTAGE: 16V  [SMD_0603_CAPC1608X95N]  (hidden comment: C)
C77  DB_VALUE: 470nF  DB_TOLERANCE: 5%  DB_VOLTAGE: 16V  [SMD_0603_CAPC1608X95N]  (hidden comment: C)
C78  DB_VALUE: 470nF  DB_TOLERANCE: 5%  DB_VOLTAGE: 16V  [SMD_0603_CAPC1608X95N]  (hidden comment: C)
C79  DB_VALUE: 470nF  DB_TOLERANCE: 5%  DB_VOLTAGE: 16V  [SMD_0603_CAPC1608X95N]  (hidden comment: C)
C80  DB_VALUE: 470nF  DB_TOLERANCE: 5%  DB_VOLTAGE: 16V  [SMD_0603_CAPC1608X95N]  (hidden comment: C)
C81  DB_VALUE: 470nF  DB_TOLERANCE: 5%  DB_VOLTAGE: 16V  [SMD_0603_CAPC1608X95N]  (hidden comment: C)
C82  DB_VALUE: 470nF  DB_TOLERANCE: 5%  DB_VOLTAGE: 16V  [SMD_0603_CAPC1608X95N]  (hidden comment: C)
C83  DB_VALUE: 470nF  DB_TOLERANCE: 5%  DB_VOLTAGE: 16V  [SMD_0603_CAPC1608X95N]  (hidden comment: C)
C84  DB_VALUE: 470nF  DB_TOLERANCE: 5%  DB_VOLTAGE: 16V  [SMD_0603_CAPC1608X95N]  (hidden comment: C)
C85  DB_VALUE: 470nF  DB_TOLERANCE: 5%  DB_VOLTAGE: 16V  [SMD_0603_CAPC1608X95N]  (hidden comment: C)
C118  DB_VALUE: 470nF  DB_TOLERANCE: 5%  DB_VOLTAGE: 16V  [SMD_0603_CAPC1608X95N]  (hidden comment: C)
C119  DB_VALUE: 470nF  DB_TOLERANCE: 5%  DB_VOLTAGE: 16V  [SMD_0603_CAPC1608X95N]  (hidden comment: C)
C120  DB_VALUE: 470nF  DB_TOLERANCE: 5%  DB_VOLTAGE: 16V  [SMD_0603_CAPC1608X95N]  (hidden comment: C)
C121  DB_VALUE: 470nF  DB_TOLERANCE: 5%  DB_VOLTAGE: 16V  [SMD_0603_CAPC1608X95N]  (hidden comment: C)
C122  DB_VALUE: 470nF  DB_TOLERANCE: 5%  DB_VOLTAGE: 16V  [SMD_0603_CAPC1608X95N]  (hidden comment: C)
C123  DB_VALUE: 470nF  DB_TOLERANCE: 5%  DB_VOLTAGE: 16V  [SMD_0603_CAPC1608X95N]  (hidden comment: C)
C124  DB_VALUE: 470nF  DB_TOLERANCE: 5%  DB_VOLTAGE: 16V  [SMD_0603_CAPC1608X95N]  (hidden comment: C)
C125  DB_VALUE: 470nF  DB_TOLERANCE: 5%  DB_VOLTAGE: 16V  [SMD_0603_CAPC1608X95N]  (hidden comment: C)
C126  DB_VALUE: 470nF  DB_TOLERANCE: 5%  DB_VOLTAGE: 16V  [SMD_0603_CAPC1608X95N]  (hidden comment: C)
C127  DB_VALUE: 470nF  DB_TOLERANCE: 5%  DB_VOLTAGE: 16V  [SMD_0603_CAPC1608X95N]  (hidden comment: C)
C128  DB_VALUE: 470nF  DB_TOLERANCE: 5%  DB_VOLTAGE: 16V  [SMD_0603_CAPC1608X95N]  (hidden comment: C)
C129  DB_VALUE: 470nF  DB_TOLERANCE: 5%  DB_VOLTAGE: 16V  [SMD_0603_CAPC1608X95N]  (hidden comment: C)
C130  DB_VALUE: 470nF  DB_TOLERANCE: 5%  DB_VOLTAGE: 16V  [SMD_0603_CAPC1608X95N]  (hidden comment: C)
C131  DB_VALUE: 470nF  DB_TOLERANCE: 5%  DB_VOLTAGE: 16V  [SMD_0603_CAPC1608X95N]  (hidden comment: C)
C132  DB_VALUE: 470nF  DB_TOLERANCE: 5%  DB_VOLTAGE: 16V  [SMD_0603_CAPC1608X95N]  (hidden comment: C)
C133  DB_VALUE: 470nF  DB_TOLERANCE: 5%  DB_VOLTAGE: 16V  [SMD_0603_CAPC1608X95N]  (hidden comment: C)
C134  DB_VALUE: 470nF  DB_TOLERANCE: 5%  DB_VOLTAGE: 16V  [SMD_0603_CAPC1608X95N]  (hidden comment: C)
C135  DB_VALUE: 470nF  DB_TOLERANCE: 5%  DB_VOLTAGE: 16V  [SMD_0603_CAPC1608X95N]  (hidden comment: C)
C136  DB_VALUE: 470nF  DB_TOLERANCE: 5%  DB_VOLTAGE: 16V  [SMD_0603_CAPC1608X95N]  (hidden comment: C)
C137  DB_VALUE: 470nF  DB_TOLERANCE: 5%  DB_VOLTAGE: 16V  [SMD_0603_CAPC1608X95N]  (hidden comment: C)
C138  C  DB_VALUE: 1nF  DB_TOLERANCE: 5%  DB_VOLTAGE: 25V  [SMD_0603_CAPC1608X95N]
C139  C  DB_VALUE: 10uF  DB_TOLERANCE: 10%  DB_VOLTAGE: 16V  [SMD_0805_CAPC2012X145N]
C140  DB_VALUE: 470nF  DB_TOLERANCE: 5%  DB_VOLTAGE: 16V  [SMD_0603_CAPC1608X95N]  (hidden comment: C)
C141  DB_VALUE: 470nF  DB_TOLERANCE: 5%  DB_VOLTAGE: 16V  [SMD_0603_CAPC1608X95N]  (hidden comment: C)
C142  DB_VALUE: 470nF  DB_TOLERANCE: 5%  DB_VOLTAGE: 16V  [SMD_0603_CAPC1608X95N]  (hidden comment: C)
C143  DB_VALUE: 470nF  DB_TOLERANCE: 5%  DB_VOLTAGE: 16V  [SMD_0603_CAPC1608X95N]  (hidden comment: C)
C144  DB_VALUE: 470nF  DB_TOLERANCE: 5%  DB_VOLTAGE: 16V  [SMD_0603_CAPC1608X95N]  (hidden comment: C)
C145  DB_VALUE: 470nF  DB_TOLERANCE: 5%  DB_VOLTAGE: 16V  [SMD_0603_CAPC1608X95N]  (hidden comment: C)
C146  DB_VALUE: 470nF  DB_TOLERANCE: 5%  DB_VOLTAGE: 16V  [SMD_0603_CAPC1608X95N]  (hidden comment: C)
C147  DB_VALUE: 470nF  DB_TOLERANCE: 5%  DB_VOLTAGE: 16V  [SMD_0603_CAPC1608X95N]  (hidden comment: C)
C148  DB_VALUE: 470nF  DB_TOLERANCE: 5%  DB_VOLTAGE: 16V  [SMD_0603_CAPC1608X95N]  (hidden comment: C)
C149  DB_VALUE: 470nF  DB_TOLERANCE: 5%  DB_VOLTAGE: 16V  [SMD_0603_CAPC1608X95N]  (hidden comment: C)
C150  DB_VALUE: 470nF  DB_TOLERANCE: 5%  DB_VOLTAGE: 16V  [SMD_0603_CAPC1608X95N]  (hidden comment: C)
C151  DB_VALUE: 470nF  DB_TOLERANCE: 5%  DB_VOLTAGE: 16V  [SMD_0603_CAPC1608X95N]  (hidden comment: C)
C152  DB_VALUE: 470nF  DB_TOLERANCE: 5%  DB_VOLTAGE: 16V  [SMD_0603_CAPC1608X95N]  (hidden comment: C)
C153  DB_VALUE: 470nF  DB_TOLERANCE: 5%  DB_VOLTAGE: 16V  [SMD_0603_CAPC1608X95N]  (hidden comment: C)
C154  DB_VALUE: 470nF  DB_TOLERANCE: 5%  DB_VOLTAGE: 16V  [SMD_0603_CAPC1608X95N]  (hidden comment: C)
C155  DB_VALUE: 470nF  DB_TOLERANCE: 5%  DB_VOLTAGE: 16V  [SMD_0603_CAPC1608X95N]  (hidden comment: C)
C156  DB_VALUE: 470nF  DB_TOLERANCE: 5%  DB_VOLTAGE: 16V  [SMD_0603_CAPC1608X95N]  (hidden comment: C)
C157  DB_VALUE: 470nF  DB_TOLERANCE: 5%  DB_VOLTAGE: 16V  [SMD_0603_CAPC1608X95N]  (hidden comment: C)
C158  DB_VALUE: 470nF  DB_TOLERANCE: 5%  DB_VOLTAGE: 16V  [SMD_0603_CAPC1608X95N]  (hidden comment: C)
C159  DB_VALUE: 470nF  DB_TOLERANCE: 5%  DB_VOLTAGE: 16V  [SMD_0603_CAPC1608X95N]  (hidden comment: C)
C160  DB_VALUE: 470nF  DB_TOLERANCE: 5%  DB_VOLTAGE: 16V  [SMD_0603_CAPC1608X95N]  (hidden comment: C)
C161  DB_VALUE: 470nF  DB_TOLERANCE: 5%  DB_VOLTAGE: 16V  [SMD_0603_CAPC1608X95N]  (hidden comment: C)
C162  DB_VALUE: 470nF  DB_TOLERANCE: 5%  DB_VOLTAGE: 16V  [SMD_0603_CAPC1608X95N]  (hidden comment: C)
C163  DB_VALUE: 470nF  DB_TOLERANCE: 5%  DB_VOLTAGE: 16V  [SMD_0603_CAPC1608X95N]  (hidden comment: C)
C166  C  DB_VALUE: 1nF  DB_TOLERANCE: 5%  DB_VOLTAGE: 25V  [SMD_0603_CAPC1608X95N]
C167  C  DB_VALUE: 100nF  DB_TOLERANCE: 5%  DB_VOLTAGE: 50V  [SMD_0603_CAPC1608X95N]
C168  C  DB_VALUE: 100nF  DB_TOLERANCE: 5%  DB_VOLTAGE: 50V  [SMD_0603_CAPC1608X95N]
C169  C  DB_VALUE: 100nF  DB_TOLERANCE: 5%  DB_VOLTAGE: 50V  [SMD_0603_CAPC1608X95N]
C170  C  DB_VALUE: 100nF  DB_TOLERANCE: 5%  DB_VOLTAGE: 50V  [SMD_0603_CAPC1608X95N]
C171  C  DB_VALUE: 100nF  DB_TOLERANCE: 5%  DB_VOLTAGE: 50V  [SMD_0603_CAPC1608X95N]
C172  C  DB_VALUE: 100nF  DB_TOLERANCE: 5%  DB_VOLTAGE: 50V  [SMD_0603_CAPC1608X95N]
C173  C  DB_VALUE: 18pF  DB_TOLERANCE: 5%  DB_VOLTAGE: 50V  [SMD_0603_CAPC1608X95N]
C174  C  DB_VALUE: 18pF  DB_TOLERANCE: 5%  DB_VOLTAGE: 50V  [SMD_0603_CAPC1608X95N]
C175  DB_VALUE: 470nF  DB_TOLERANCE: 5%  DB_VOLTAGE: 16V  [SMD_0603_CAPC1608X95N]  (hidden comment: C)
C176  DB_VALUE: 470nF  DB_TOLERANCE: 5%  DB_VOLTAGE: 16V  [SMD_0603_CAPC1608X95N]  (hidden comment: C)
C177  DB_VALUE: 470nF  DB_TOLERANCE: 5%  DB_VOLTAGE: 16V  [SMD_0603_CAPC1608X95N]  (hidden comment: C)
C178  DB_VALUE: 470nF  DB_TOLERANCE: 5%  DB_VOLTAGE: 16V  [SMD_0603_CAPC1608X95N]  (hidden comment: C)
C179  DB_VALUE: 470nF  DB_TOLERANCE: 5%  DB_VOLTAGE: 16V  [SMD_0603_CAPC1608X95N]  (hidden comment: C)
C180  DB_VALUE: 470nF  DB_TOLERANCE: 5%  DB_VOLTAGE: 16V  [SMD_0603_CAPC1608X95N]  (hidden comment: C)
C181  DB_VALUE: 470nF  DB_TOLERANCE: 5%  DB_VOLTAGE: 16V  [SMD_0603_CAPC1608X95N]  (hidden comment: C)
C182  DB_VALUE: 470nF  DB_TOLERANCE: 5%  DB_VOLTAGE: 16V  [SMD_0603_CAPC1608X95N]  (hidden comment: C)
C183  DB_VALUE: 470nF  DB_TOLERANCE: 5%  DB_VOLTAGE: 16V  [SMD_0603_CAPC1608X95N]  (hidden comment: C)
C184  DB_VALUE: 470nF  DB_TOLERANCE: 5%  DB_VOLTAGE: 16V  [SMD_0603_CAPC1608X95N]  (hidden comment: C)
C185  DB_VALUE: 470nF  DB_TOLERANCE: 5%  DB_VOLTAGE: 16V  [SMD_0603_CAPC1608X95N]  (hidden comment: C)
C186  DB_VALUE: 470nF  DB_TOLERANCE: 5%  DB_VOLTAGE: 16V  [SMD_0603_CAPC1608X95N]  (hidden comment: C)
C187  DB_VALUE: 470nF  DB_TOLERANCE: 5%  DB_VOLTAGE: 16V  [SMD_0603_CAPC1608X95N]  (hidden comment: C)
C188  DB_VALUE: 470nF  DB_TOLERANCE: 5%  DB_VOLTAGE: 16V  [SMD_0603_CAPC1608X95N]  (hidden comment: C)
C189  DB_VALUE: 470nF  DB_TOLERANCE: 5%  DB_VOLTAGE: 16V  [SMD_0603_CAPC1608X95N]  (hidden comment: C)
C190  DB_VALUE: 470nF  DB_TOLERANCE: 5%  DB_VOLTAGE: 16V  [SMD_0603_CAPC1608X95N]  (hidden comment: C)
C191  C  DB_VALUE: 10uF  DB_TOLERANCE: 10%  DB_VOLTAGE: 16V  [SMD_0805_CAPC2012X145N]
C224  DB_VALUE: 220uF  DB_TOLERANCE: 20%  DB_VOLTAGE: 6.3V  [SMD_1210_CAPC3225X279N]  (hidden comment: C)
C225  C  DB_VALUE: 22uF  DB_TOLERANCE: 20%  DB_VOLTAGE: 6.3V  [SMD_0805_CAPC2012X145N]
C226  C  DB_VALUE: 10uF  DB_TOLERANCE: 10%  DB_VOLTAGE: 16V  [SMD_0805_CAPC2012X145N]
C227  DB_VALUE: 470nF  DB_TOLERANCE: 5%  DB_VOLTAGE: 16V  [SMD_0603_CAPC1608X95N]  (hidden comment: C)
C228  DB_VALUE: 470nF  DB_TOLERANCE: 5%  DB_VOLTAGE: 16V  [SMD_0603_CAPC1608X95N]  (hidden comment: C)
C229  DB_VALUE: 470nF  DB_TOLERANCE: 5%  DB_VOLTAGE: 16V  [SMD_0603_CAPC1608X95N]  (hidden comment: C)
C230  DB_VALUE: 470nF  DB_TOLERANCE: 5%  DB_VOLTAGE: 16V  [SMD_0603_CAPC1608X95N]  (hidden comment: C)
C231  DB_VALUE: 470nF  DB_TOLERANCE: 5%  DB_VOLTAGE: 16V  [SMD_0603_CAPC1608X95N]  (hidden comment: C)
C232  DB_VALUE: 470nF  DB_TOLERANCE: 5%  DB_VOLTAGE: 16V  [SMD_0603_CAPC1608X95N]  (hidden comment: C)
C233  DB_VALUE: 470nF  DB_TOLERANCE: 5%  DB_VOLTAGE: 16V  [SMD_0603_CAPC1608X95N]  (hidden comment: C)
C234  DB_VALUE: 470nF  DB_TOLERANCE: 5%  DB_VOLTAGE: 16V  [SMD_0603_CAPC1608X95N]  (hidden comment: C)
C235  DB_VALUE: 470nF  DB_TOLERANCE: 5%  DB_VOLTAGE: 16V  [SMD_0603_CAPC1608X95N]  (hidden comment: C)
C236  DB_VALUE: 470nF  DB_TOLERANCE: 5%  DB_VOLTAGE: 16V  [SMD_0603_CAPC1608X95N]  (hidden comment: C)
C237  DB_VALUE: 470nF  DB_TOLERANCE: 5%  DB_VOLTAGE: 16V  [SMD_0603_CAPC1608X95N]  (hidden comment: C)
C238  DB_VALUE: 470nF  DB_TOLERANCE: 5%  DB_VOLTAGE: 16V  [SMD_0603_CAPC1608X95N]  (hidden comment: C)
C239  DB_VALUE: 470nF  DB_TOLERANCE: 5%  DB_VOLTAGE: 16V  [SMD_0603_CAPC1608X95N]  (hidden comment: C)
C240  DB_VALUE: 470nF  DB_TOLERANCE: 5%  DB_VOLTAGE: 16V  [SMD_0603_CAPC1608X95N]  (hidden comment: C)
C241  DB_VALUE: 470nF  DB_TOLERANCE: 5%  DB_VOLTAGE: 16V  [SMD_0603_CAPC1608X95N]  (hidden comment: C)
C242  DB_VALUE: 470nF  DB_TOLERANCE: 5%  DB_VOLTAGE: 16V  [SMD_0603_CAPC1608X95N]  (hidden comment: C)
C243  DB_VALUE: 470nF  DB_TOLERANCE: 5%  DB_VOLTAGE: 16V  [SMD_0603_CAPC1608X95N]  (hidden comment: C)
C244  DB_VALUE: 470nF  DB_TOLERANCE: 5%  DB_VOLTAGE: 16V  [SMD_0603_CAPC1608X95N]  (hidden comment: C)
C245  DB_VALUE: 470nF  DB_TOLERANCE: 5%  DB_VOLTAGE: 16V  [SMD_0603_CAPC1608X95N]  (hidden comment: C)
C246  DB_VALUE: 470nF  DB_TOLERANCE: 5%  DB_VOLTAGE: 16V  [SMD_0603_CAPC1608X95N]  (hidden comment: C)
C247  DB_VALUE: 470nF  DB_TOLERANCE: 5%  DB_VOLTAGE: 16V  [SMD_0603_CAPC1608X95N]  (hidden comment: C)
C248  DB_VALUE: 470nF  DB_TOLERANCE: 5%  DB_VOLTAGE: 16V  [SMD_0603_CAPC1608X95N]  (hidden comment: C)
C249  DB_VALUE: 470nF  DB_TOLERANCE: 5%  DB_VOLTAGE: 16V  [SMD_0603_CAPC1608X95N]  (hidden comment: C)
C250  DB_VALUE: 470nF  DB_TOLERANCE: 5%  DB_VOLTAGE: 16V  [SMD_0603_CAPC1608X95N]  (hidden comment: C)
C251  DB_VALUE: 470nF  DB_TOLERANCE: 5%  DB_VOLTAGE: 16V  [SMD_0603_CAPC1608X95N]  (hidden comment: C)
C252  DB_VALUE: 470nF  DB_TOLERANCE: 5%  DB_VOLTAGE: 16V  [SMD_0603_CAPC1608X95N]  (hidden comment: C)
C253  DB_VALUE: 470nF  DB_TOLERANCE: 5%  DB_VOLTAGE: 16V  [SMD_0603_CAPC1608X95N]  (hidden comment: C)
C254  DB_VALUE: 470nF  DB_TOLERANCE: 5%  DB_VOLTAGE: 16V  [SMD_0603_CAPC1608X95N]  (hidden comment: C)
C255  DB_VALUE: 470nF  DB_TOLERANCE: 5%  DB_VOLTAGE: 16V  [SMD_0603_CAPC1608X95N]  (hidden comment: C)
C256  DB_VALUE: 470nF  DB_TOLERANCE: 5%  DB_VOLTAGE: 16V  [SMD_0603_CAPC1608X95N]  (hidden comment: C)
C257  DB_VALUE: 470nF  DB_TOLERANCE: 5%  DB_VOLTAGE: 16V  [SMD_0603_CAPC1608X95N]  (hidden comment: C)
C258  DB_VALUE: 470nF  DB_TOLERANCE: 5%  DB_VOLTAGE: 16V  [SMD_0603_CAPC1608X95N]  (hidden comment: C)
C259  C  DB_VALUE: 22uF  DB_TOLERANCE: 20%  DB_VOLTAGE: 6.3V  [SMD_0805_CAPC2012X145N]
C260  C  DB_VALUE: 100nF  DB_TOLERANCE: 5%  DB_VOLTAGE: 50V  [SMD_0603_CAPC1608X95N]
C261  C  DB_VALUE: 100nF  DB_TOLERANCE: 5%  DB_VOLTAGE: 50V  [SMD_0603_CAPC1608X95N]
C262  DB_VALUE: 470nF  DB_TOLERANCE: 5%  DB_VOLTAGE: 16V  [SMD_0603_CAPC1608X95N]  (hidden comment: C)
C263  DB_VALUE: 470nF  DB_TOLERANCE: 5%  DB_VOLTAGE: 16V  [SMD_0603_CAPC1608X95N]  (hidden comment: C)
C264  DB_VALUE: 470nF  DB_TOLERANCE: 5%  DB_VOLTAGE: 16V  [SMD_0603_CAPC1608X95N]  (hidden comment: C)
C265  DB_VALUE: 470nF  DB_TOLERANCE: 5%  DB_VOLTAGE: 16V  [SMD_0603_CAPC1608X95N]  (hidden comment: C)
C266  DB_VALUE: 470nF  DB_TOLERANCE: 5%  DB_VOLTAGE: 16V  [SMD_0603_CAPC1608X95N]  (hidden comment: C)
C267  DB_VALUE: 470nF  DB_TOLERANCE: 5%  DB_VOLTAGE: 16V  [SMD_0603_CAPC1608X95N]  (hidden comment: C)
C268  DB_VALUE: 470nF  DB_TOLERANCE: 5%  DB_VOLTAGE: 16V  [SMD_0603_CAPC1608X95N]  (hidden comment: C)
C269  DB_VALUE: 470nF  DB_TOLERANCE: 5%  DB_VOLTAGE: 16V  [SMD_0603_CAPC1608X95N]  (hidden comment: C)
C270  DB_VALUE: 470nF  DB_TOLERANCE: 5%  DB_VOLTAGE: 16V  [SMD_0603_CAPC1608X95N]  (hidden comment: C)
C271  DB_VALUE: 470nF  DB_TOLERANCE: 5%  DB_VOLTAGE: 16V  [SMD_0603_CAPC1608X95N]  (hidden comment: C)
C272  DB_VALUE: 470nF  DB_TOLERANCE: 5%  DB_VOLTAGE: 16V  [SMD_0603_CAPC1608X95N]  (hidden comment: C)
C273  DB_VALUE: 470nF  DB_TOLERANCE: 5%  DB_VOLTAGE: 16V  [SMD_0603_CAPC1608X95N]  (hidden comment: C)
C274  C  DB_VALUE: 22uF  DB_TOLERANCE: 20%  DB_VOLTAGE: 6.3V  [SMD_0805_CAPC2012X145N]
C275  C  DB_VALUE: 10uF  DB_TOLERANCE: 10%  DB_VOLTAGE: 16V  [SMD_0805_CAPC2012X145N]
C276  DB_VALUE: 470nF  DB_TOLERANCE: 5%  DB_VOLTAGE: 16V  [SMD_0603_CAPC1608X95N]  (hidden comment: C)
C277  DB_VALUE: 470nF  DB_TOLERANCE: 5%  DB_VOLTAGE: 16V  [SMD_0603_CAPC1608X95N]  (hidden comment: C)
C278  DB_VALUE: 470nF  DB_TOLERANCE: 5%  DB_VOLTAGE: 16V  [SMD_0603_CAPC1608X95N]  (hidden comment: C)
C279  DB_VALUE: 470nF  DB_TOLERANCE: 5%  DB_VOLTAGE: 16V  [SMD_0603_CAPC1608X95N]  (hidden comment: C)
C280  DB_VALUE: 470nF  DB_TOLERANCE: 5%  DB_VOLTAGE: 16V  [SMD_0603_CAPC1608X95N]  (hidden comment: C)
C281  DB_VALUE: 470nF  DB_TOLERANCE: 5%  DB_VOLTAGE: 16V  [SMD_0603_CAPC1608X95N]  (hidden comment: C)
C282  DB_VALUE: 470nF  DB_TOLERANCE: 5%  DB_VOLTAGE: 16V  [SMD_0603_CAPC1608X95N]  (hidden comment: C)
C283  DB_VALUE: 470nF  DB_TOLERANCE: 5%  DB_VOLTAGE: 16V  [SMD_0603_CAPC1608X95N]  (hidden comment: C)
C284  DB_VALUE: 470nF  DB_TOLERANCE: 5%  DB_VOLTAGE: 16V  [SMD_0603_CAPC1608X95N]  (hidden comment: C)
C285  DB_VALUE: 470nF  DB_TOLERANCE: 5%  DB_VOLTAGE: 16V  [SMD_0603_CAPC1608X95N]  (hidden comment: C)
C286  DB_VALUE: 470nF  DB_TOLERANCE: 5%  DB_VOLTAGE: 16V  [SMD_0603_CAPC1608X95N]  (hidden comment: C)
C287  DB_VALUE: 470nF  DB_TOLERANCE: 5%  DB_VOLTAGE: 16V  [SMD_0603_CAPC1608X95N]  (hidden comment: C)
C288  DB_VALUE: 470nF  DB_TOLERANCE: 5%  DB_VOLTAGE: 16V  [SMD_0603_CAPC1608X95N]  (hidden comment: C)
C289  DB_VALUE: 470nF  DB_TOLERANCE: 5%  DB_VOLTAGE: 16V  [SMD_0603_CAPC1608X95N]  (hidden comment: C)
C290  DB_VALUE: 470nF  DB_TOLERANCE: 5%  DB_VOLTAGE: 16V  [SMD_0603_CAPC1608X95N]  (hidden comment: C)
C291  DB_VALUE: 470nF  DB_TOLERANCE: 5%  DB_VOLTAGE: 16V  [SMD_0603_CAPC1608X95N]  (hidden comment: C)
C324  DB_VALUE: 470nF  DB_TOLERANCE: 5%  DB_VOLTAGE: 16V  [SMD_0603_CAPC1608X95N]  (hidden comment: C)
C325  DB_VALUE: 470nF  DB_TOLERANCE: 5%  DB_VOLTAGE: 16V  [SMD_0603_CAPC1608X95N]  (hidden comment: C)
C326  DB_VALUE: 470nF  DB_TOLERANCE: 5%  DB_VOLTAGE: 16V  [SMD_0603_CAPC1608X95N]  (hidden comment: C)
C327  DB_VALUE: 470nF  DB_TOLERANCE: 5%  DB_VOLTAGE: 16V  [SMD_0603_CAPC1608X95N]  (hidden comment: C)
C328  DB_VALUE: 470nF  DB_TOLERANCE: 5%  DB_VOLTAGE: 16V  [SMD_0603_CAPC1608X95N]  (hidden comment: C)
C329  DB_VALUE: 470nF  DB_TOLERANCE: 5%  DB_VOLTAGE: 16V  [SMD_0603_CAPC1608X95N]  (hidden comment: C)
C330  DB_VALUE: 470nF  DB_TOLERANCE: 5%  DB_VOLTAGE: 16V  [SMD_0603_CAPC1608X95N]  (hidden comment: C)
C331  DB_VALUE: 470nF  DB_TOLERANCE: 5%  DB_VOLTAGE: 16V  [SMD_0603_CAPC1608X95N]  (hidden comment: C)
C332  DB_VALUE: 470nF  DB_TOLERANCE: 5%  DB_VOLTAGE: 16V  [SMD_0603_CAPC1608X95N]  (hidden comment: C)
C333  DB_VALUE: 470nF  DB_TOLERANCE: 5%  DB_VOLTAGE: 16V  [SMD_0603_CAPC1608X95N]  (hidden comment: C)
C334  DB_VALUE: 470nF  DB_TOLERANCE: 5%  DB_VOLTAGE: 16V  [SMD_0603_CAPC1608X95N]  (hidden comment: C)
C335  DB_VALUE: 470nF  DB_TOLERANCE: 5%  DB_VOLTAGE: 16V  [SMD_0603_CAPC1608X95N]  (hidden comment: C)
C336  DB_VALUE: 470nF  DB_TOLERANCE: 5%  DB_VOLTAGE: 16V  [SMD_0603_CAPC1608X95N]  (hidden comment: C)
C337  DB_VALUE: 470nF  DB_TOLERANCE: 5%  DB_VOLTAGE: 16V  [SMD_0603_CAPC1608X95N]  (hidden comment: C)
C338  DB_VALUE: 470nF  DB_TOLERANCE: 5%  DB_VOLTAGE: 16V  [SMD_0603_CAPC1608X95N]  (hidden comment: C)
C339  DB_VALUE: 470nF  DB_TOLERANCE: 5%  DB_VOLTAGE: 16V  [SMD_0603_CAPC1608X95N]  (hidden comment: C)
C340  DB_VALUE: 470nF  DB_TOLERANCE: 5%  DB_VOLTAGE: 16V  [SMD_0603_CAPC1608X95N]  (hidden comment: C)
C341  DB_VALUE: 470nF  DB_TOLERANCE: 5%  DB_VOLTAGE: 16V  [SMD_0603_CAPC1608X95N]  (hidden comment: C)
C342  DB_VALUE: 470nF  DB_TOLERANCE: 5%  DB_VOLTAGE: 16V  [SMD_0603_CAPC1608X95N]  (hidden comment: C)
C343  DB_VALUE: 470nF  DB_TOLERANCE: 5%  DB_VOLTAGE: 16V  [SMD_0603_CAPC1608X95N]  (hidden comment: C)
C344  DB_VALUE: 470nF  DB_TOLERANCE: 5%  DB_VOLTAGE: 16V  [SMD_0603_CAPC1608X95N]  (hidden comment: C)
C345  DB_VALUE: 470nF  DB_TOLERANCE: 5%  DB_VOLTAGE: 16V  [SMD_0603_CAPC1608X95N]  (hidden comment: C)
C346  DB_VALUE: 470nF  DB_TOLERANCE: 5%  DB_VOLTAGE: 16V  [SMD_0603_CAPC1608X95N]  (hidden comment: C)
C347  DB_VALUE: 470nF  DB_TOLERANCE: 5%  DB_VOLTAGE: 16V  [SMD_0603_CAPC1608X95N]  (hidden comment: C)
C348  DB_VALUE: 470nF  DB_TOLERANCE: 5%  DB_VOLTAGE: 16V  [SMD_0603_CAPC1608X95N]  (hidden comment: C)
C349  DB_VALUE: 470nF  DB_TOLERANCE: 5%  DB_VOLTAGE: 16V  [SMD_0603_CAPC1608X95N]  (hidden comment: C)
C350  DB_VALUE: 470nF  DB_TOLERANCE: 5%  DB_VOLTAGE: 16V  [SMD_0603_CAPC1608X95N]  (hidden comment: C)
C351  DB_VALUE: 470nF  DB_TOLERANCE: 5%  DB_VOLTAGE: 16V  [SMD_0603_CAPC1608X95N]  (hidden comment: C)
C352  DB_VALUE: 470nF  DB_TOLERANCE: 5%  DB_VOLTAGE: 16V  [SMD_0603_CAPC1608X95N]  (hidden comment: C)
C353  DB_VALUE: 470nF  DB_TOLERANCE: 5%  DB_VOLTAGE: 16V  [SMD_0603_CAPC1608X95N]  (hidden comment: C)
C354  DB_VALUE: 470nF  DB_TOLERANCE: 5%  DB_VOLTAGE: 16V  [SMD_0603_CAPC1608X95N]  (hidden comment: C)
C355  DB_VALUE: 470nF  DB_TOLERANCE: 5%  DB_VOLTAGE: 16V  [SMD_0603_CAPC1608X95N]  (hidden comment: C)
C356  DB_VALUE: 470nF  DB_TOLERANCE: 5%  DB_VOLTAGE: 16V  [SMD_0603_CAPC1608X95N]  (hidden comment: C)
C357  DB_VALUE: 470nF  DB_TOLERANCE: 5%  DB_VOLTAGE: 16V  [SMD_0603_CAPC1608X95N]  (hidden comment: C)
C358  DB_VALUE: 470nF  DB_TOLERANCE: 5%  DB_VOLTAGE: 16V  [SMD_0603_CAPC1608X95N]  (hidden comment: C)
C359  DB_VALUE: 470nF  DB_TOLERANCE: 5%  DB_VOLTAGE: 16V  [SMD_0603_CAPC1608X95N]  (hidden comment: C)
C360  DB_VALUE: 470nF  DB_TOLERANCE: 5%  DB_VOLTAGE: 16V  [SMD_0603_CAPC1608X95N]  (hidden comment: C)
C361  DB_VALUE: 470nF  DB_TOLERANCE: 5%  DB_VOLTAGE: 16V  [SMD_0603_CAPC1608X95N]  (hidden comment: C)
C362  DB_VALUE: 470nF  DB_TOLERANCE: 5%  DB_VOLTAGE: 16V  [SMD_0603_CAPC1608X95N]  (hidden comment: C)
C363  DB_VALUE: 470nF  DB_TOLERANCE: 5%  DB_VOLTAGE: 16V  [SMD_0603_CAPC1608X95N]  (hidden comment: C)
C364  DB_VALUE: 470nF  DB_TOLERANCE: 5%  DB_VOLTAGE: 16V  [SMD_0603_CAPC1608X95N]  (hidden comment: C)
C365  DB_VALUE: 470nF  DB_TOLERANCE: 5%  DB_VOLTAGE: 16V  [SMD_0603_CAPC1608X95N]  (hidden comment: C)
C366  DB_VALUE: 470nF  DB_TOLERANCE: 5%  DB_VOLTAGE: 16V  [SMD_0603_CAPC1608X95N]  (hidden comment: C)
C367  DB_VALUE: 470nF  DB_TOLERANCE: 5%  DB_VOLTAGE: 16V  [SMD_0603_CAPC1608X95N]  (hidden comment: C)
C368  DB_VALUE: 470nF  DB_TOLERANCE: 5%  DB_VOLTAGE: 16V  [SMD_0603_CAPC1608X95N]  (hidden comment: C)
C369  DB_VALUE: 470nF  DB_TOLERANCE: 5%  DB_VOLTAGE: 16V  [SMD_0603_CAPC1608X95N]  (hidden comment: C)
C370  DB_VALUE: 470nF  DB_TOLERANCE: 5%  DB_VOLTAGE: 16V  [SMD_0603_CAPC1608X95N]  (hidden comment: C)
C371  DB_VALUE: 470nF  DB_TOLERANCE: 5%  DB_VOLTAGE: 16V  [SMD_0603_CAPC1608X95N]  (hidden comment: C)
C372  DB_VALUE: 470nF  DB_TOLERANCE: 5%  DB_VOLTAGE: 16V  [SMD_0603_CAPC1608X95N]  (hidden comment: C)
C373  DB_VALUE: 470nF  DB_TOLERANCE: 5%  DB_VOLTAGE: 16V  [SMD_0603_CAPC1608X95N]  (hidden comment: C)
C374  DB_VALUE: 470nF  DB_TOLERANCE: 5%  DB_VOLTAGE: 16V  [SMD_0603_CAPC1608X95N]  (hidden comment: C)
C375  DB_VALUE: 470nF  DB_TOLERANCE: 5%  DB_VOLTAGE: 16V  [SMD_0603_CAPC1608X95N]  (hidden comment: C)
C376  DB_VALUE: 470nF  DB_TOLERANCE: 5%  DB_VOLTAGE: 16V  [SMD_0603_CAPC1608X95N]  (hidden comment: C)
C377  DB_VALUE: 470nF  DB_TOLERANCE: 5%  DB_VOLTAGE: 16V  [SMD_0603_CAPC1608X95N]  (hidden comment: C)
C378  DB_VALUE: 470nF  DB_TOLERANCE: 5%  DB_VOLTAGE: 16V  [SMD_0603_CAPC1608X95N]  (hidden comment: C)
C379  DB_VALUE: 470nF  DB_TOLERANCE: 5%  DB_VOLTAGE: 16V  [SMD_0603_CAPC1608X95N]  (hidden comment: C)
C380  DB_VALUE: 470nF  DB_TOLERANCE: 5%  DB_VOLTAGE: 16V  [SMD_0603_CAPC1608X95N]  (hidden comment: C)
C381  DB_VALUE: 470nF  DB_TOLERANCE: 5%  DB_VOLTAGE: 16V  [SMD_0603_CAPC1608X95N]  (hidden comment: C)
C382  DB_VALUE: 470nF  DB_TOLERANCE: 5%  DB_VOLTAGE: 16V  [SMD_0603_CAPC1608X95N]  (hidden comment: C)
C383  DB_VALUE: 470nF  DB_TOLERANCE: 5%  DB_VOLTAGE: 16V  [SMD_0603_CAPC1608X95N]  (hidden comment: C)
C_1  DB_VALUE: 220uF  DB_TOLERANCE: 20%  DB_VOLTAGE: 6.3V  [SMD_1210_CAPC3225X279N]  (hidden comment: C)
C_2  DB_VALUE: 220uF  DB_TOLERANCE: 20%  DB_VOLTAGE: 6.3V  [SMD_1210_CAPC3225X279N]  (hidden comment: C)
C_3  DB_VALUE: 220uF  DB_TOLERANCE: 20%  DB_VOLTAGE: 6.3V  [SMD_1210_CAPC3225X279N]  (hidden comment: C)
C_4  DB_VALUE: 220uF  DB_TOLERANCE: 20%  DB_VOLTAGE: 6.3V  [SMD_1210_CAPC3225X279N]  (hidden comment: C)
C_5  DB_VALUE: 220uF  DB_TOLERANCE: 20%  DB_VOLTAGE: 6.3V  [SMD_1210_CAPC3225X279N]  (hidden comment: C)
C_6  DB_VALUE: 220uF  DB_TOLERANCE: 20%  DB_VOLTAGE: 6.3V  [SMD_1210_CAPC3225X279N]  (hidden comment: C)
C_7  DB_VALUE: 220uF  DB_TOLERANCE: 20%  DB_VOLTAGE: 6.3V  [SMD_1210_CAPC3225X279N]  (hidden comment: C)
C_8  DB_VALUE: 220uF  DB_TOLERANCE: 20%  DB_VOLTAGE: 6.3V  [SMD_1210_CAPC3225X279N]  (hidden comment: C)
C_9  DB_VALUE: 220uF  DB_TOLERANCE: 20%  DB_VOLTAGE: 6.3V  [SMD_1210_CAPC3225X279N]  (hidden comment: C)
C_10  DB_VALUE: 220uF  DB_TOLERANCE: 20%  DB_VOLTAGE: 6.3V  [SMD_1210_CAPC3225X279N]  (hidden comment: C)
C_11  DB_VALUE: 220uF  DB_TOLERANCE: 20%  DB_VOLTAGE: 6.3V  [SMD_1210_CAPC3225X279N]  (hidden comment: C)
C_12  DB_VALUE: 220uF  DB_TOLERANCE: 20%  DB_VOLTAGE: 6.3V  [SMD_1210_CAPC3225X279N]  (hidden comment: C)
C_13  DB_VALUE: 220uF  DB_TOLERANCE: 20%  DB_VOLTAGE: 6.3V  [SMD_1210_CAPC3225X279N]  (hidden comment: C)
C_14  DB_VALUE: 220uF  DB_TOLERANCE: 20%  DB_VOLTAGE: 6.3V  [SMD_1210_CAPC3225X279N]  (hidden comment: C)
C_15  DB_VALUE: 220uF  DB_TOLERANCE: 20%  DB_VOLTAGE: 6.3V  [SMD_1210_CAPC3225X279N]  (hidden comment: C)
C_16  DB_VALUE: 220uF  DB_TOLERANCE: 20%  DB_VOLTAGE: 6.3V  [SMD_1210_CAPC3225X279N]  (hidden comment: C)
C_17  DB_VALUE: 220uF  DB_TOLERANCE: 20%  DB_VOLTAGE: 6.3V  [SMD_1210_CAPC3225X279N]  (hidden comment: C)
C_18  DB_VALUE: 220uF  DB_TOLERANCE: 20%  DB_VOLTAGE: 6.3V  [SMD_1210_CAPC3225X279N]  (hidden comment: C)
C_19  DB_VALUE: 220uF  DB_TOLERANCE: 20%  DB_VOLTAGE: 6.3V  [SMD_1210_CAPC3225X279N]  (hidden comment: C)
C_20  DB_VALUE: 220uF  DB_TOLERANCE: 20%  DB_VOLTAGE: 6.3V  [SMD_1210_CAPC3225X279N]  (hidden comment: C)
C_21  DB_VALUE: 220uF  DB_TOLERANCE: 20%  DB_VOLTAGE: 6.3V  [SMD_1210_CAPC3225X279N]  (hidden comment: C)
C_22  DB_VALUE: 220uF  DB_TOLERANCE: 20%  DB_VOLTAGE: 6.3V  [SMD_1210_CAPC3225X279N]  (hidden comment: C)
C_23  DB_VALUE: 220uF  DB_TOLERANCE: 20%  DB_VOLTAGE: 6.3V  [SMD_1210_CAPC3225X279N]  (hidden comment: C)
C_24  DB_VALUE: 220uF  DB_TOLERANCE: 20%  DB_VOLTAGE: 6.3V  [SMD_1210_CAPC3225X279N]  (hidden comment: C)
C_25  DB_VALUE: 220uF  DB_TOLERANCE: 20%  DB_VOLTAGE: 6.3V  [SMD_1210_CAPC3225X279N]  (hidden comment: C)
C_26  DB_VALUE: 220uF  DB_TOLERANCE: 20%  DB_VOLTAGE: 6.3V  [SMD_1210_CAPC3225X279N]  (hidden comment: C)
C_27  DB_VALUE: 220uF  DB_TOLERANCE: 20%  DB_VOLTAGE: 6.3V  [SMD_1210_CAPC3225X279N]  (hidden comment: C)
C_28  DB_VALUE: 220uF  DB_TOLERANCE: 20%  DB_VOLTAGE: 6.3V  [SMD_1210_CAPC3225X279N]  (hidden comment: C)
C_29  DB_VALUE: 220uF  DB_TOLERANCE: 20%  DB_VOLTAGE: 6.3V  [SMD_1210_CAPC3225X279N]  (hidden comment: C)
C_30  DB_VALUE: 220uF  DB_TOLERANCE: 20%  DB_VOLTAGE: 6.3V  [SMD_1210_CAPC3225X279N]  (hidden comment: C)
C_31  DB_VALUE: 220uF  DB_TOLERANCE: 20%  DB_VOLTAGE: 6.3V  [SMD_1210_CAPC3225X279N]  (hidden comment: C)
C_32  DB_VALUE: 220uF  DB_TOLERANCE: 20%  DB_VOLTAGE: 6.3V  [SMD_1210_CAPC3225X279N]  (hidden comment: C)
C_33  DB_VALUE: 220uF  DB_TOLERANCE: 20%  DB_VOLTAGE: 6.3V  [SMD_1210_CAPC3225X279N]  (hidden comment: C)
C_34  DB_VALUE: 220uF  DB_TOLERANCE: 20%  DB_VOLTAGE: 6.3V  [SMD_1210_CAPC3225X279N]  (hidden comment: C)
C_35  DB_VALUE: 220uF  DB_TOLERANCE: 20%  DB_VOLTAGE: 6.3V  [SMD_1210_CAPC3225X279N]  (hidden comment: C)
C_36  DB_VALUE: 220uF  DB_TOLERANCE: 20%  DB_VOLTAGE: 6.3V  [SMD_1210_CAPC3225X279N]  (hidden comment: C)
C_37  DB_VALUE: 220uF  DB_TOLERANCE: 20%  DB_VOLTAGE: 6.3V  [SMD_1210_CAPC3225X279N]  (hidden comment: C)
C_38  DB_VALUE: 220uF  DB_TOLERANCE: 20%  DB_VOLTAGE: 6.3V  [SMD_1210_CAPC3225X279N]  (hidden comment: C)
C_39  DB_VALUE: 220uF  DB_TOLERANCE: 20%  DB_VOLTAGE: 6.3V  [SMD_1210_CAPC3225X279N]  (hidden comment: C)
C_40  DB_VALUE: 220uF  DB_TOLERANCE: 20%  DB_VOLTAGE: 6.3V  [SMD_1210_CAPC3225X279N]  (hidden comment: C)
C_41  DB_VALUE: 220uF  DB_TOLERANCE: 20%  DB_VOLTAGE: 6.3V  [SMD_1210_CAPC3225X279N]  (hidden comment: C)
C_42  DB_VALUE: 220uF  DB_TOLERANCE: 20%  DB_VOLTAGE: 6.3V  [SMD_1210_CAPC3225X279N]  (hidden comment: C)
C_43  DB_VALUE: 220uF  DB_TOLERANCE: 20%  DB_VOLTAGE: 6.3V  [SMD_1210_CAPC3225X279N]  (hidden comment: C)
C_44  DB_VALUE: 220uF  DB_TOLERANCE: 20%  DB_VOLTAGE: 6.3V  [SMD_1210_CAPC3225X279N]  (hidden comment: C)
C_45  DB_VALUE: 220uF  DB_TOLERANCE: 20%  DB_VOLTAGE: 6.3V  [SMD_1210_CAPC3225X279N]  (hidden comment: C)
C_46  DB_VALUE: 220uF  DB_TOLERANCE: 20%  DB_VOLTAGE: 6.3V  [SMD_1210_CAPC3225X279N]  (hidden comment: C)
C_47  DB_VALUE: 220uF  DB_TOLERANCE: 20%  DB_VOLTAGE: 6.3V  [SMD_1210_CAPC3225X279N]  (hidden comment: C)
C_48  DB_VALUE: 220uF  DB_TOLERANCE: 20%  DB_VOLTAGE: 6.3V  [SMD_1210_CAPC3225X279N]  (hidden comment: C)
C_49  DB_VALUE: 220uF  DB_TOLERANCE: 20%  DB_VOLTAGE: 6.3V  [SMD_1210_CAPC3225X279N]  (hidden comment: C)
C_50  DB_VALUE: 220uF  DB_TOLERANCE: 20%  DB_VOLTAGE: 6.3V  [SMD_1210_CAPC3225X279N]  (hidden comment: C)
C_51  DB_VALUE: 220uF  DB_TOLERANCE: 20%  DB_VOLTAGE: 6.3V  [SMD_1210_CAPC3225X279N]  (hidden comment: C)
C_52  DB_VALUE: 220uF  DB_TOLERANCE: 20%  DB_VOLTAGE: 6.3V  [SMD_1210_CAPC3225X279N]  (hidden comment: C)
C_53  DB_VALUE: 220uF  DB_TOLERANCE: 20%  DB_VOLTAGE: 6.3V  [SMD_1210_CAPC3225X279N]  (hidden comment: C)
C_54  DB_VALUE: 220uF  DB_TOLERANCE: 20%  DB_VOLTAGE: 6.3V  [SMD_1210_CAPC3225X279N]  (hidden comment: C)
C_55  DB_VALUE: 220uF  DB_TOLERANCE: 20%  DB_VOLTAGE: 6.3V  [SMD_1210_CAPC3225X279N]  (hidden comment: C)
C_56  DB_VALUE: 220uF  DB_TOLERANCE: 20%  DB_VOLTAGE: 6.3V  [SMD_1210_CAPC3225X279N]  (hidden comment: C)
C_57  DB_VALUE: 220uF  DB_TOLERANCE: 20%  DB_VOLTAGE: 6.3V  [SMD_1210_CAPC3225X279N]  (hidden comment: C)
C_58  DB_VALUE: 220uF  DB_TOLERANCE: 20%  DB_VOLTAGE: 6.3V  [SMD_1210_CAPC3225X279N]  (hidden comment: C)
C_59  DB_VALUE: 220uF  DB_TOLERANCE: 20%  DB_VOLTAGE: 6.3V  [SMD_1210_CAPC3225X279N]  (hidden comment: C)
C_60  DB_VALUE: 220uF  DB_TOLERANCE: 20%  DB_VOLTAGE: 6.3V  [SMD_1210_CAPC3225X279N]  (hidden comment: C)
C_61  DB_VALUE: 220uF  DB_TOLERANCE: 20%  DB_VOLTAGE: 6.3V  [SMD_1210_CAPC3225X279N]  (hidden comment: C)
C_62  DB_VALUE: 220uF  DB_TOLERANCE: 20%  DB_VOLTAGE: 6.3V  [SMD_1210_CAPC3225X279N]  (hidden comment: C)
C_63  DB_VALUE: 220uF  DB_TOLERANCE: 20%  DB_VOLTAGE: 6.3V  [SMD_1210_CAPC3225X279N]  (hidden comment: C)
C_64  DB_VALUE: 220uF  DB_TOLERANCE: 20%  DB_VOLTAGE: 6.3V  [SMD_1210_CAPC3225X279N]  (hidden comment: C)
C_65  DB_VALUE: 220uF  DB_TOLERANCE: 20%  DB_VOLTAGE: 6.3V  [SMD_1210_CAPC3225X279N]  (hidden comment: C)
C_66  DB_VALUE: 220uF  DB_TOLERANCE: 20%  DB_VOLTAGE: 6.3V  [SMD_1210_CAPC3225X279N]  (hidden comment: C)
C_67  DB_VALUE: 220uF  DB_TOLERANCE: 20%  DB_VOLTAGE: 6.3V  [SMD_1210_CAPC3225X279N]  (hidden comment: C)
C_68  DB_VALUE: 220uF  DB_TOLERANCE: 20%  DB_VOLTAGE: 6.3V  [SMD_1210_CAPC3225X279N]  (hidden comment: C)
C_69  DB_VALUE: 220uF  DB_TOLERANCE: 20%  DB_VOLTAGE: 6.3V  [SMD_1210_CAPC3225X279N]  (hidden comment: C)
C_70  DB_VALUE: 220uF  DB_TOLERANCE: 20%  DB_VOLTAGE: 6.3V  [SMD_1210_CAPC3225X279N]  (hidden comment: C)
C_71  DB_VALUE: 220uF  DB_TOLERANCE: 20%  DB_VOLTAGE: 6.3V  [SMD_1210_CAPC3225X279N]  (hidden comment: C)
C_72  DB_VALUE: 220uF  DB_TOLERANCE: 20%  DB_VOLTAGE: 6.3V  [SMD_1210_CAPC3225X279N]  (hidden comment: C)
D1  D_STKY_DUAL_A1A2CC3  DB_VALUE: BAT54C  [SMD_SOT23_SOT95P240X120-3N]
D2  D_STKY_DUAL_A1A2CC3  DB_VALUE: BAT54C  [SMD_SOT23_SOT95P240X120-3N]
D3  D_STKY_DUAL_A1A2CC3  DB_VALUE: BAT54C  [SMD_SOT23_SOT95P240X120-3N]
D4  Red SML210VT ROHM  [SMD_0805_LED2012X100N]
D5  Green 	SML210MT ROHM  [SMD_0805_LED2012X100N]
D6  Yellow SML210YT ROHM  [SMD_0805_LED2012X100N]
D7  Orange 	SML210DT ROHM  [SMD_0805_LED2012X100N]
D8  D_STKY  DB_VALUE: B140  [SMD_DO214AC_SMA]
D9  D_TVS_QUAD_C1A2C3C4A5C6  DB_VALUE: SMS05T1G  [SMD_SOT457_SOT95P275X110-6N]
D10  D_STKY  DB_VALUE: B140  [SMD_DO214AC_SMA]
D11  D_STKY  DB_VALUE: B140  [SMD_DO214AC_SMA]
D12  D_TVS_UNI  DB_VALUE: SMCJ12A  [SMD_DO214AC_SMC]
FB1  L_FERRITE_BEAD  DB_VALUE: 220 Ohms  DB_CURRENT: 2A  [SMD_0805_INDC2012X105N]
FID1  FIDUCIAL  [FID100X200]
FID2  FIDUCIAL  [FID100X200]
J1  CON_5PINS  DB_VALUE: CONN PCB 5P M S  [PTH_HDRV05W64P254_1X05]
J2  CON_USB_MINI_1  DB_VALUE: USB MINI  [SMD_CON-CVILUX-CU04-SCM15B0]
J3  CON_3PINS  DB_VALUE: HD-351-3P  [PTH_CON_HD-351-3P]
J4  CON_2ROWS_6PINS_1  DB_VALUE: WR-MPC4  [PTH_CON_WR-MRC4-6P]
J5  CON_1PIN  [PTH_MTG400_700]
J6  CON_1PIN  [PTH_MTG400_700]
J7  CON_1PIN  [PTH_MTG400_700]
J8  CON_1PIN  [PTH_MTG400_700]
J9  CON_1PIN  [PTH_MTG400_700]
J10  CON_1PIN  [PTH_MTG400_700]
J11  CON_1PIN  [PTH_MTG400_700]
J12  CON_1PIN  [PTH_MTG400_700]
J13  CON_1PIN  [PTH_MTG400_700]
J14  CON_1PIN  [PTH_MTG400_700]
J15  CON_1PIN  [PTH_MTG400_700]
L1  SLC1480-201MLD  [SMT_INDM135130X800N]
L2  SLC1480-201MLD  [SMT_INDM135130X800N]
L3  SLC1480-201MLD  [SMT_INDM135130X800N]
Q1  DB_VALUE: AP1RA03GMT-HF-3  [SMD_SOIC127P600X110-9AN]  (hidden comment: MOS_N_D1_S1S2S3G4D5D6D7D8)
Q2  DB_VALUE: AP1RA03GMT-HF-3  [SMD_SOIC127P600X110-9AN]  (hidden comment: MOS_N_D1_S1S2S3G4D5D6D7D8)
Q3  DB_VALUE: AP1RA03GMT-HF-3  [SMD_SOIC127P600X110-9AN]  (hidden comment: MOS_N_D1_S1S2S3G4D5D6D7D8)
Q4  DB_VALUE: AP1RA03GMT-HF-3  [SMD_SOIC127P600X110-9AN]  (hidden comment: MOS_N_D1_S1S2S3G4D5D6D7D8)
Q5  DB_VALUE: AP1RA03GMT-HF-3  [SMD_SOIC127P600X110-9AN]  (hidden comment: MOS_N_D1_S1S2S3G4D5D6D7D8)
Q6  DB_VALUE: AP1RA03GMT-HF-3  [SMD_SOIC127P600X110-9AN]  (hidden comment: MOS_N_D1_S1S2S3G4D5D6D7D8)
Q7  DB_VALUE: AP1RA03GMT-HF-3  [SMD_SOIC127P600X110-9AN]  (hidden comment: MOS_N_D1_S1S2S3G4D5D6D7D8)
Q8  DB_VALUE: AP1RA03GMT-HF-3  [SMD_SOIC127P600X110-9AN]  (hidden comment: MOS_N_D1_S1S2S3G4D5D6D7D8)
Q9  DB_VALUE: AP1RA03GMT-HF-3  [SMD_SOIC127P600X110-9AN]  (hidden comment: MOS_N_D1_S1S2S3G4D5D6D7D8)
R1  DB_VALUE: 10k  DB_TOLERANCE: 1%  [SMD_0603_RESC1608X55N]  (hidden comment: R)
R2  DB_VALUE: 10k  DB_TOLERANCE: 1%  [SMD_0603_RESC1608X55N]  (hidden comment: R)
R3  DB_VALUE: 10k  DB_TOLERANCE: 1%  [SMD_0603_RESC1608X55N]  (hidden comment: R)
R4  DB_VALUE: 10k  DB_TOLERANCE: 1%  [SMD_0603_RESC1608X55N]  (hidden comment: R)
R5  DB_VALUE: 10k  DB_TOLERANCE: 1%  [SMD_0603_RESC1608X55N]  (hidden comment: R)
R6  DB_VALUE: 10k  DB_TOLERANCE: 1%  [SMD_0603_RESC1608X55N]  (hidden comment: R)
R7  DB_VALUE: 10k  DB_TOLERANCE: 1%  [SMD_0603_RESC1608X55N]  (hidden comment: R)
R8  DB_VALUE: 10k  DB_TOLERANCE: 1%  [SMD_0603_RESC1608X55N]  (hidden comment: R)
R17  DB_VALUE: 10k  DB_TOLERANCE: 1%  [SMD_0603_RESC1608X55N]  (hidden comment: R)
R18  DB_VALUE: 10k  DB_TOLERANCE: 1%  [SMD_0603_RESC1608X55N]  (hidden comment: R)
R19  DB_VALUE: 10k  DB_TOLERANCE: 1%  [SMD_0603_RESC1608X55N]  (hidden comment: R)
R20  DB_VALUE: 10k  DB_TOLERANCE: 1%  [SMD_0603_RESC1608X55N]  (hidden comment: R)
R21  DB_VALUE: 10k  DB_TOLERANCE: 1%  [SMD_0603_RESC1608X55N]  (hidden comment: R)
R22  DB_VALUE: 10k  DB_TOLERANCE: 1%  [SMD_0603_RESC1608X55N]  (hidden comment: R)
R23  DB_VALUE: 10k  DB_TOLERANCE: 1%  [SMD_0603_RESC1608X55N]  (hidden comment: R)
R24  DB_VALUE: 10k  DB_TOLERANCE: 1%  [SMD_0603_RESC1608X55N]  (hidden comment: R)
R25  DB_VALUE: 2.4k  DB_TOLERANCE: 1%  [SMD_0603_RESC1608X55N]  (hidden comment: R)
R26  DB_VALUE: 10k  DB_TOLERANCE: 1%  [SMD_0603_RESC1608X55N]  (hidden comment: R)
R27  DB_VALUE: 47R  DB_TOLERANCE: 1%  [SMD_0603_RESC1608X55N]  (hidden comment: R)
R30  DB_VALUE: 47R  DB_TOLERANCE: 1%  [SMD_0603_RESC1608X55N]  (hidden comment: R)
R31  DB_VALUE: 10k  DB_TOLERANCE: 1%  [SMD_0603_RESC1608X55N]  (hidden comment: R)
R32  DB_VALUE: 10k  DB_TOLERANCE: 1%  [SMD_0603_RESC1608X55N]  (hidden comment: R)
R33  DB_VALUE: 0R  DB_TOLERANCE: 1%  [SMD_0603_RESC1608X55N]  (hidden comment: R)
R42  DB_VALUE: 2R  DB_TOLERANCE: 5%  [SMD_1206_RESC3216X65N]  (hidden comment: R)
R43  DB_VALUE: 10k  DB_TOLERANCE: 1%  [SMD_0603_RESC1608X55N]  (hidden comment: R)
R44  DB_VALUE: 10k  DB_TOLERANCE: 1%  [SMD_0603_RESC1608X55N]  (hidden comment: R)
R45  DB_VALUE: 10k  DB_TOLERANCE: 1%  [SMD_0603_RESC1608X55N]  (hidden comment: R)
R46  DB_VALUE: 10k  DB_TOLERANCE: 1%  [SMD_0603_RESC1608X55N]  (hidden comment: R)
R47  DB_VALUE: 100R  DB_TOLERANCE: 1%  [SMD_1206_RESC3216X65N]  (hidden comment: R)
R48  DB_VALUE: 0R  DB_TOLERANCE: 1%  [SMD_1206_RESC3216X65N]  (hidden comment: R)
R49  R  DB_VALUE: 0R  DB_TOLERANCE: 1%  [SMD_1206_RESC3216X65N]
R50  DB_VALUE: 10k  DB_TOLERANCE: 1%  [SMD_0603_RESC1608X55N]  (hidden comment: R)
R51  DB_VALUE: 30k  DB_TOLERANCE: 1%  [SMD_0603_RESC1608X55N]  (hidden comment: R)
R52  DB_VALUE: 10k  DB_TOLERANCE: 1%  [SMD_0603_RESC1608X55N]  (hidden comment: R)
R53  DB_VALUE: 10k  DB_TOLERANCE: 1%  [SMD_0603_RESC1608X55N]  (hidden comment: R)
R54  DB_VALUE: 10k  DB_TOLERANCE: 1%  [SMD_0603_RESC1608X55N]  (hidden comment: R)
R55  DB_VALUE: 30k  DB_TOLERANCE: 1%  [SMD_0603_RESC1608X55N]  (hidden comment: R)
R64  DB_VALUE: 10k  DB_TOLERANCE: 1%  [SMD_0603_RESC1608X55N]  (hidden comment: R)
R65  DB_VALUE: 10k  DB_TOLERANCE: 1%  [SMD_0603_RESC1608X55N]  (hidden comment: R)
R66  DB_VALUE: 10k  DB_TOLERANCE: 1%  [SMD_0603_RESC1608X55N]  (hidden comment: R)
R67  DB_VALUE: 10k  DB_TOLERANCE: 1%  [SMD_0603_RESC1608X55N]  (hidden comment: R)
TP1  TEST_POINT_1  [SMD_TP_100-254]  (value not drawn)
TP2  TEST_POINT_1  [SMD_TP_100-254]  (value not drawn)
TP3  TEST_POINT_1  [SMD_TP_100-254]  (value not drawn)
TP4  TEST_POINT_1  [SMD_TP_100-254]  (value not drawn)
TP5  TEST_POINT_1  [SMD_TP_100-254]  (value not drawn)
TP6  TEST_POINT_1  [SMD_TP_100-254]  (value not drawn)
TP7  TEST_POINT_1  [SMD_TP_100-254]  (value not drawn)
TP8  TEST_POINT_1  [SMD_TP_100-254]  (value not drawn)
TP9  TEST_POINT_1  [SMD_TP_100-254]  (value not drawn)
TP10  TEST_POINT_1  [SMD_TP_100-254]  (value not drawn)
TP11  TEST_POINT_1  [SMD_TP_100-254]  (value not drawn)
TP12  TEST_POINT_1  [SMD_TP_100-254]  (value not drawn)
TP13  TEST_POINT_1  [SMD_TP_100-254]  (value not drawn)
TP14  TEST_POINT_1  [SMD_TP_100-254]  (value not drawn)
TP15  TEST_POINT_1  [SMD_TP_100-254]  (value not drawn)
TP16  TEST_POINT_1  [SMD_TP_100-254]  (value not drawn)
TP17  TEST_POINT_1  [SMD_TP_100-254]  (value not drawn)
TP18  TEST_POINT_1  [SMD_TP_100-254]  (value not drawn)
TP19  TEST_POINT_1  [SMD_TP_100-254]  (value not drawn)
TP20  TEST_POINT_1  [SMD_TP_100-254]  (value not drawn)
TP21  TEST_POINT_1  [SMD_TP_100-254]  (value not drawn)
TP22  TEST_POINT_1  [SMD_TP_100-254]  (value not drawn)
TP23  TEST_POINT_1  [SMD_TP_100-254]  (value not drawn)
TP24  TEST_POINT_1  [SMD_TP_100-254]  (value not drawn)
TP25  TEST_POINT_1  [SMD_TP_100-254]  (value not drawn)
TP26  TEST_POINT_1  [SMD_TP_100-254]  (value not drawn)
TP27  TEST_POINT_1  [SMD_TP_100-254]  (value not drawn)
TP28  TEST_POINT_1  [SMD_TP_100-254]  (value not drawn)
TP29  TEST_POINT_1  [SMD_TP_100-254]  (value not drawn)
TP30  TEST_POINT_1  [SMD_TP_100-254]  (value not drawn)
TP31  TEST_POINT_1  [SMD_TP_100-254]  (value not drawn)
TP32  TEST_POINT_1  [SMD_TP_100-254]  (value not drawn)
TP33  TEST_POINT_1  [SMD_TP_100-254]  (value not drawn)
TP34  TEST_POINT_1  [SMD_TP_100-254]  (value not drawn)
TP35  TEST_POINT_1  [SMD_TP_100-254]  (value not drawn)
TP36  TEST_POINT_1  [SMD_TP_100-254]  (value not drawn)
TP37  TEST_POINT_1  [SMD_TP_100-254]  (value not drawn)
TP38  TEST_POINT_1  [SMD_TP_100-254]  (value not drawn)
TP39  TEST_POINT_1  [SMD_TP_100-254]  (value not drawn)
TP40  TEST_POINT_1  [SMD_TP_100-254]  (value not drawn)
TP41  TEST_POINT_1  [SMD_TP_100-254]  (value not drawn)
TP42  TEST_POINT_1  [SMD_TP_100-254]  (value not drawn)
TP43  TEST_POINT_1  [SMD_TP_100-254]  (value not drawn)
TP44  TEST_POINT_1  [SMD_TP_100-254]  (value not drawn)
TP45  TEST_POINT_1  [SMD_TP_100-254]  (value not drawn)
TP46  TEST_POINT_1  [SMD_TP_100-254]  (value not drawn)
TP47  TEST_POINT_1  [SMD_TP_100-254]  (value not drawn)
TP48  TEST_POINT_1  [SMD_TP_100-254]  (value not drawn)
TP49  TEST_POINT_1  [SMD_TP_100-254]  (value not drawn)
TP50  TEST_POINT_1  [SMD_TP_100-254]  (value not drawn)
TP51  TEST_POINT_1  [SMD_TP_100-254]  (value not drawn)
TP52  TEST_POINT_1  [SMD_TP_100-254]  (value not drawn)
TP53  TEST_POINT_1  [SMD_TP_100-254]  (value not drawn)
TP54  TEST_POINT_1  [SMD_TP_100-254]  (value not drawn)
U1  IC_LTC4449  DB_VALUE: LTC4449EDCB#TRPBF  [SMD_SON45P300X200X80-9N]
U2  IC_LTC4449  DB_VALUE: LTC4449EDCB#TRPBF  [SMD_SON45P300X200X80-9N]
U3  IC_LTC4449  DB_VALUE: LTC4449EDCB#TRPBF  [SMD_SON45P300X200X80-9N]
U4  GC3355Q64  [SMT_QFN40P800X800X90-65N]
U5  GC3355Q64  [SMT_QFN40P800X800X90-65N]
U6  GC3355Q64  [SMT_QFN40P800X800X90-65N]
U7  GC3355Q64  [SMT_QFN40P800X800X90-65N]
U8  IC_DSPIC33EP256MU806-QFN64  DB_VALUE: dsPIC33EP256MU806  [SMD_QFP50P1200X1200X120-64N]
U9  GC3355Q64  [SMT_QFN40P800X800X90-65N]
U10  GC3355Q64  [SMT_QFN40P800X800X90-65N]
U11  GC3355Q64  [SMT_QFN40P800X800X90-65N]
U12  GC3355Q64  [SMT_QFN40P800X800X90-65N]
U13  (OPT) LM7805  DB_VALUE: AP78L05SG-13  [SMD_SOIC127P600X175-8N]
U14  IC_TLV70033QDDCRQ1  DB_VALUE: BU33TD3WG-TR  [SMD_SOT95P280X135-5N]
U15  IC_BDXXKA5WF  DB_VALUE: BD33KA5WF-E2  [SMD_SOIC127P620X160-8N]
U16  DB_VALUE: L7805CD2T-TR  [SMD_TO254P1542X460-3_4N]  (hidden comment: IC_IN1OUT3GND4)
U17  IC_VIN1GND4VOUT3  DB_VALUE: MC78M05BDTRKG  [SMD_TO229P991X239-4N_DPAK]
U18  GC3355Q64  [SMT_QFN40P800X800X90-65N]
U19  GC3355Q64  [SMT_QFN40P800X800X90-65N]
U20  GC3355Q64  [SMT_QFN40P800X800X90-65N]
U21  GC3355Q64  [SMT_QFN40P800X800X90-65N]
U22  IC_BD00KA5WF  DB_VALUE: BD00KA5WF-E2  [SMD_SOIC127P620X160-8N]
U23  IC_BD00KA5WF  DB_VALUE: BD00KA5WF-E2  [SMD_SOIC127P620X160-8N]
U24  GC3355Q64  [SMT_QFN40P800X800X90-65N]
U25  GC3355Q64  [SMT_QFN40P800X800X90-65N]
U26  GC3355Q64  [SMT_QFN40P800X800X90-65N]
U27  GC3355Q64  [SMT_QFN40P800X800X90-65N]
Y1  XTAL  DB_VALUE: 4.00MHz HC49/4HSMX  [SMD_HC49_XTAL1140X480X420N]